# Altium project S3220A.PrjPcb
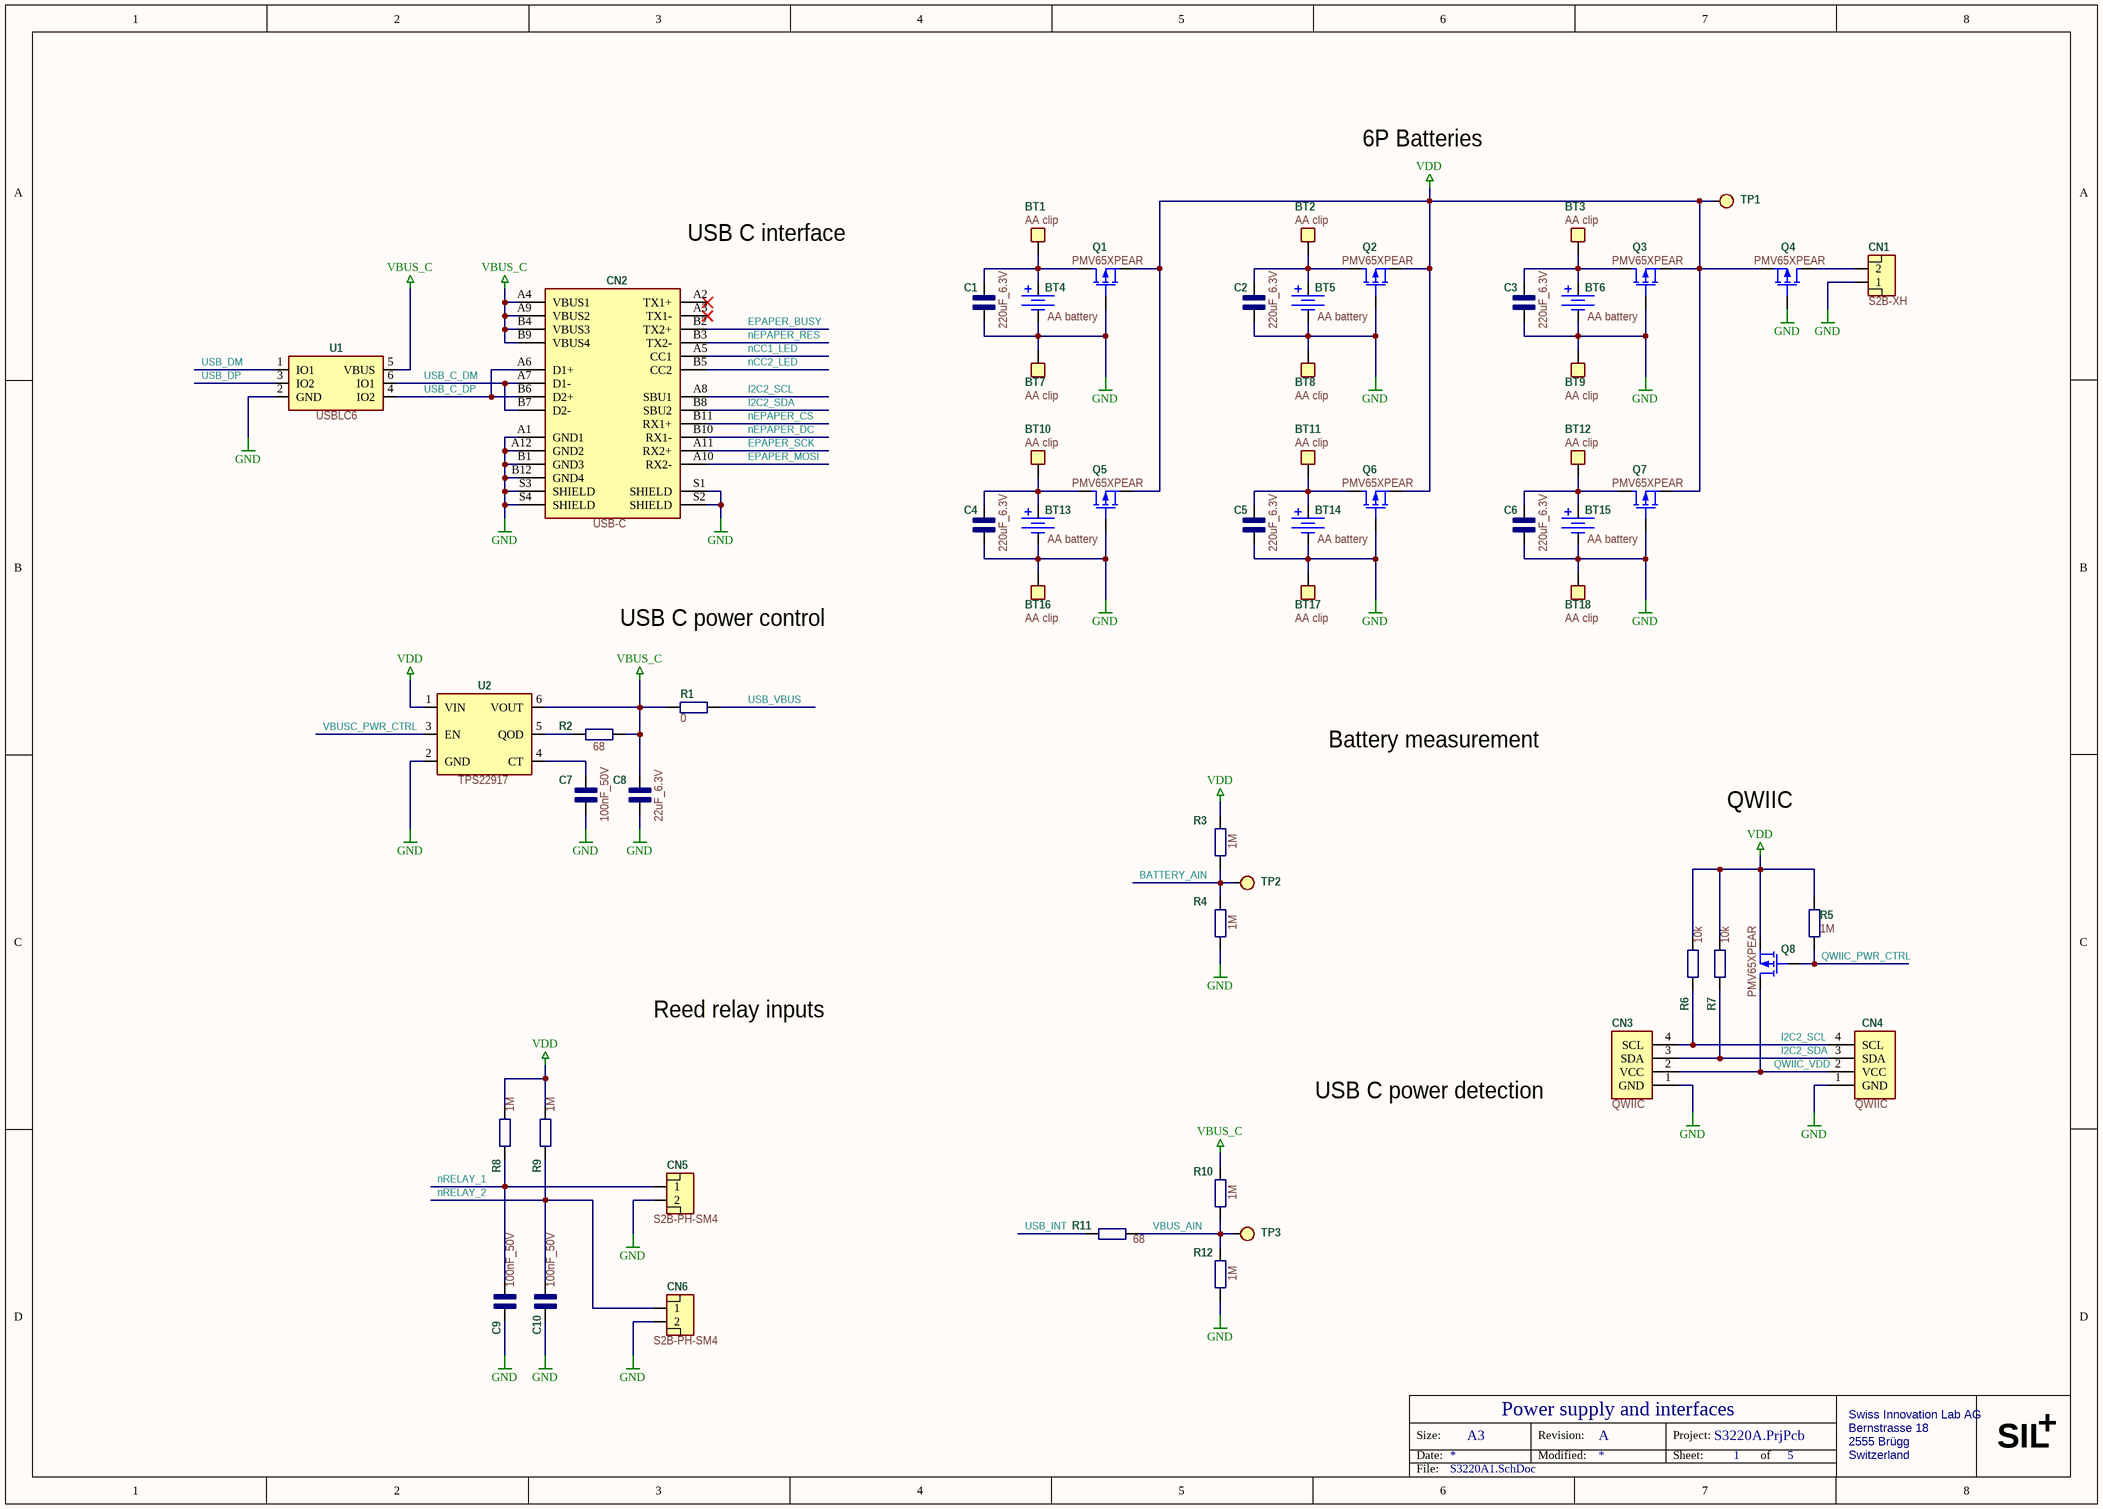
[diagram p0: S3220A1.SchDoc]
4 sheets, 238 parts. Net scope: global (net labels, ports and power ports of the same name join across sheets).
Board files: S3220A.PcbDoc, Panelized_S3220A.PcbDoc
Sheets:
  S3220A1.SchDoc
  S3220A2.SchDoc
  S3220A3.SchDoc
  S3220A4.SchDoc

## Sheet S3220A1.SchDoc: Power supply and interfaces
size A3; Revision: A; SheetNumber: 1; SheetTotal: 5

### Parts
BT1  AA clip  [BT_AA-TH-CLIP]  (no BOM)
BT2  AA clip  [BT_AA-TH-CLIP]  (no BOM)
BT3  AA clip  [BT_AA-TH-CLIP]  (no BOM)
BT4  AA battery  [BT_AA-battery]  (no BOM)
BT5  AA battery  [BT_AA-battery]  (no BOM)
BT6  AA battery  [BT_AA-battery]  (no BOM)
BT7  AA clip  [BT_AA-TH-CLIP]  (no BOM)
BT8  AA clip  [BT_AA-TH-CLIP]  (no BOM)
BT9  AA clip  [BT_AA-TH-CLIP]  (no BOM)
BT10  AA clip  [BT_AA-TH-CLIP]  (no BOM)
BT11  AA clip  [BT_AA-TH-CLIP]  (no BOM)
BT12  AA clip  [BT_AA-TH-CLIP]  (no BOM)
BT13  AA battery  [BT_AA-battery]  (no BOM)
BT14  AA battery  [BT_AA-battery]  (no BOM)
BT15  AA battery  [BT_AA-battery]  (no BOM)
BT16  AA clip  [BT_AA-TH-CLIP]  (no BOM)
BT17  AA clip  [BT_AA-TH-CLIP]  (no BOM)
BT18  AA clip  [BT_AA-TH-CLIP]  (no BOM)
C1  220uF_6.3V  [C_1206]
C2  220uF_6.3V  [C_1206]
C3  220uF_6.3V  [C_1206]
C4  220uF_6.3V  [C_1206]
C5  220uF_6.3V  [C_1206]
C6  220uF_6.3V  [C_1206]
C7  100nF_50V  [C_0603]
C8  22uF_6.3V  [C_0603]
C9  100nF_50V  [C_0603]
C10  100nF_50V  [C_0603]
CN1  S2B-XH  [CN_S2B-XH-A]
CN2  USB-C  [CN_USB-C-RA_2]
CN3  QWIIC  [CN_SM04B-SRSS-TB]
CN4  QWIIC  [CN_SM04B-SRSS-TB]
CN5  S2B-PH-SM4  [CN_S2B-PH-SM4]
CN6  S2B-PH-SM4  [CN_S2B-PH-SM4]
Q1  PMV65XPEAR  [U_SOT23-3]
Q2  PMV65XPEAR  [U_SOT23-3]
Q3  PMV65XPEAR  [U_SOT23-3]
Q4  PMV65XPEAR  [U_SOT23-3]
Q5  PMV65XPEAR  [U_SOT23-3]
Q6  PMV65XPEAR  [U_SOT23-3]
Q7  PMV65XPEAR  [U_SOT23-3]
Q8  PMV65XPEAR  [U_SOT23-3]
R1  0  [R_0603]
R2  68  [R_0603]
R3  1M  [R_0603]
R4  1M  [R_0603]
R5  1M  [R_0603]
R6  10k  [R_0603]
R7  10k  [R_0603]
R8  1M  [R_0603]
R9  1M  [R_0603]
R10  1M  [R_0603]
R11  68  [R_0603]
R12  1M  [R_0603]
TP1  Test point  [TP_SMD_R1.0mm]  (value not drawn)  (no BOM)
TP2  Test point  [TP_SMD_R1.0mm]  (value not drawn)  (no BOM)
TP3  Test point  [TP_SMD_R1.0mm]  (value not drawn)  (no BOM)
U1  USBLC6  [U_SOT23-6]
U2  TPS22917  [U_SOT23-6]

### Nets
GND: BT7.1 BT8.1 BT9.1 BT16.1 BT17.1 BT18.1 C1.1 C2.1 C3.1 C4.1 C5.1 C6.1 C7.1 C8.1 C9.1 C10.1 CN1.1 CN2.A1(GND1) CN2.A12(GND2) CN2.B1(GND3) CN2.B12(GND4) CN2.S1(SHIELD) CN2.S2(SHIELD) CN2.S3(SHIELD) CN2.S4(SHIELD) CN3.1(GND) CN4.1(GND) CN5.2 CN6.2 Q1.1(G) Q2.1(G) Q3.1(G) Q4.1(G) Q5.1(G) Q6.1(G) Q7.1(G) R4.1 R12.1 U1.2(GND) U2.2(GND)
VBUS_C: C8.2 CN2.A4(VBUS1) CN2.A9(VBUS2) CN2.B4(VBUS3) CN2.B9(VBUS4) R1.1 R2.1 R10.2 U1.5(VBUS) U2.6(VOUT)
VDD: Q1.2(S) Q2.2(S) Q3.2(S) Q4.2(S) Q5.2(S) Q6.2(S) Q7.2(S) Q8.2(S) R3.2 R5.2 R6.2 R7.2 R8.2 R9.2 TP1.1 U2.1(VIN)
BATTERY_AIN: R3.1 R4.2 TP2.1
EPAPER_BUSY: CN2.B2(TX2+)
EPAPER_MOSI: CN2.A10(RX2-)
EPAPER_SCK: CN2.A11(RX2+)
I2C2_SCL: CN2.A8(SBU1) CN3.4(SCL) CN4.4(SCL) R6.1
I2C2_SDA: CN2.B8(SBU2) CN3.3(SDA) CN4.3(SDA) R7.1
nCC1_LED: CN2.A5(CC1)
nCC2_LED: CN2.B5(CC2)
nEPAPER_CS: CN2.B11(RX1+)
nEPAPER_DC: CN2.B10(RX1-)
nEPAPER_RES: CN2.B3(TX2-)
nRELAY_1: C9.2 CN5.1 R8.1
nRELAY_2: C10.2 CN6.1 R9.1
QWIIC_PWR_CTRL: Q8.1(G) R5.1
QWIIC_VDD: CN3.2(VCC) CN4.2(VCC) Q8.3(D)
USB_C_DM: CN2.A7(D1-) CN2.B7(D2-) U1.6(IO1)
USB_C_DP: CN2.A6(D1+) CN2.B6(D2+) U1.4(IO2)
USB_DM: U1.1(IO1)
USB_DP: U1.3(IO2)
USB_INT: R11.1
USB_VBUS: R1.2
VBUS_AIN: R10.1 R11.2 R12.2 TP3.1
VBUSC_PWR_CTRL: U2.3(EN)
NetBT1_1: BT1.1 C1.2 Q1.3(D)
NetBT2_1: BT2.1 C2.2 Q2.3(D)
NetBT3_1: BT3.1 C3.2 Q3.3(D)
NetBT10_1: BT10.1 C4.2 Q5.3(D)
NetBT11_1: BT11.1 C5.2 Q6.3(D)
NetBT12_1: BT12.1 C6.2 Q7.3(D)
NetC7_2: C7.2 U2.4(CT)
NetCN1_2: CN1.2 Q4.3(D)
NetR2_2: R2.2 U2.5(QOD)

Not connected (* = marked no-connect by the designer): CN2 A2(TX1+)* A3(TX1-)*

### Notes on the sheet
- 6P Batteries
- USB C interface
- USB C power control
- Battery measurement
- QWIIC
- Reed relay inputs
- USB C power detection
- Size:
- Date:
- A3
- Revision:
- Modified:
- Project:
- Sheet:
- of
- Swiss Innovation Lab AG
- Bernstrasse 18
- 2555 Brügg
- Switzerland
- SIL
- +
- File:

### Library data of the parts
BT1-BT3 BT7-BT12 BT16-BT18 = BT_AA-TH-CLIP: Battery Contact Clip A, AA 1 Cell PC Pin; Manufacturer: Keystone Electronics; Manufacturer Part Number: 92; Currency: $; Value: AA clip; Price: 0,20178; Supplier 1: Digi-Key; Supplier Part Number 1: 36-92-ND
BT4-BT6 BT13-BT15 = BT_AA-battery: Manufacturer: SIL; Currency: $; Value: AA battery; Supplier 1: SIL
C1-C6 = C_220uF_6.3V: 220µF ±20% 6.3V Ceramic Capacitor X5R 1206 (3216 Metric); Manufacturer: Murata Electronics North America; Manufacturer Part Number: GRM31CR60J227ME11L; Value: 220uF; ValueAux: _6.3V; Currency: $; Price: 0,59945; Supplier 1: Digi-Key; Supplier Part Number 1: 490-13970-1-ND
C7 C9 C10 = C_100nF_50V: 0.1µF ±10% 50V Ceramic Capacitor X7R 0603 (1608 Metric); Manufacturer: TDK; Manufacturer Part Number: C1608X7R1H104K080AA; Value: 100nF; ValueAux: _50V; Currency: $; Price: 0,01309; Supplier 1: Digi-Key; Supplier Part Number 1: 445-1314-6-ND
C8 = C_22uF_6V3: 22µF ±20% 6.3V Ceramic Capacitor X5R 0603 (1608 Metric); Manufacturer: Samsung Electro-Mechanics; Manufacturer Part Number: CL10A226MQ8NRNC; Value: 22uF; ValueAux: _6.3V; Currency: $; Price: 0,04566; Supplier 1: Digi-Key; Supplier Part Number 1: 1276-1193-1-ND
CN1 = CN_S2B-XH: Connector Header Through Hole, Right Angle 2 position 0.098" (2.50mm); Manufacturer: JST Sales America Inc.; Manufacturer Part Number: S2B-XH-A(LF)(SN); Currency: $; Supplier 1: Digi-Key; Supplier Part Number 1: 455-2257-ND; Value: S2B-XH; Price: 0,07792
CN2 = CN_USB-C-RA_2: USB-C (USB TYPE-C) USB 3.2 Gen 2 (USB 3.1 Gen 2, Superspeed + (USB 3.1)) Receptacle Connector 24 Position Surface Mount, Right Angle; Through Hole; Manufacturer: CUI Devices; Manufacturer Part Number: UJ31-CH-G-SMT-TR-67; Currency: $; Value: USB-C; Price: 2,43252; Supplier 1: Digi-Key; Supplier Part Number 1: 2223-UJ31-CH-G-SMT-TR-67CT-ND
CN3 CN4 = CN_QWICC: Connector Header Surface Mount, Right Angle 4 position 0.039" (1.00mm); Manufacturer: JST Sales America Inc.; Manufacturer Part Number: SM04B-SRSS-TB(LF)(SN); Currency: $; Supplier 1: Digi-Key; Supplier Part Number 1: 455-1804-1-ND; Value: QWIIC; Price: 0,61
CN5 CN6 = CN_S2B-PH-SM4: Connector Header Surface Mount, Right Angle 2 position 0.079" (2.00mm); Manufacturer: JST Sales America Inc.; Manufacturer Part Number: S2B-PH-SM4-TB(LF)(SN); Currency: $; Supplier 1: Digi-Key; Supplier Part Number 1: 455-1749-1-ND; Value: S2B-PH-SM4; Price: 0,36470
Q1-Q8 = Q_PMV65: P-Channel 20V 2.8A (Ta) 480mW (Ta), 6.25W (Tc) Surface Mount TO-236AB (SOT23); Manufacturer: Nexperia USA Inc.; Currency: $; Value: PMV65XPEAR; Manufacturer Part Number: PMV65XPEAR; Price: 0,11204; Supplier 1: Digi-Key; Supplier Part Number 1: 1727-2310-1-ND
R1 = R_0_1%: 0 Ohms Jumper 0.1W, 1/10W Chip Resistor 0603 (1608 Metric) Automotive AEC-Q200 Thick Film; Manufacturer: Panasonic Electronic Components; Manufacturer Part Number: ERJ-3GEY0R00V; Currency: $; Value: 0; Price: 0,00962; Supplier 1: Digi-Key; Supplier Part Number 1: P0.0GCT-ND
R2 R11 = R_68_1%: 68 Ohms ±1% 0.1W, 1/10W Chip Resistor 0603 (1608 Metric) Automotive AEC-Q200 Thick Film; Manufacturer: Panasonic Electronic Components; Manufacturer Part Number: ERJ-3EKF68R0V; Currency: $; Value: 68; Price: 0,01449; Supplier 1: Digi-Key; Supplier Part Number 1: P68.0HCT-ND
R3-R5 R8-R10 R12 = R_1M_1%: 1 MOhms ±1% 0.1W, 1/10W Chip Resistor 0603 (1608 Metric) Automotive AEC-Q200 Thick Film; Manufacturer: Panasonic Electronic Components; Manufacturer Part Number: ERJ-3EKF1004V; Currency: $; Value: 1M; Price: 0,01264; Supplier 1: Digi-Key; Supplier Part Number 1: P1.00MHCT-ND
R6 R7 = R_10k_1%: 10 kOhms ±1% 0.1W, 1/10W Chip Resistor 0603 (1608 Metric) Automotive AEC-Q200 Thick Film; Manufacturer: Panasonic Electronic Components; Manufacturer Part Number: ERJ-3EKF1002V; Currency: $; Value: 10k; Price: 0,01449; Supplier 1: Digi-Key; Supplier Part Number 1: P10.0KHCT-ND
TP1-TP3 = TP_Test_point: Manufacturer: Swiss Innovation Lab; Currency: $; Value: Test point; Manufacturer Part Number: Test point; Price: 0
U1 = U_USBLC6: TVS DIODE 5.25V 17V SOT23-6; Manufacturer: STMicroelectronics; Manufacturer Part Number: USBLC6-2SC6Y; Currency: $; Value: USBLC6; Price: 0,33501; Supplier 1: Digi-Key; Supplier Part Number 1: 497-11882-6-ND
U2 = U_TPS22917: Power Switch/Driver 1:1 P-Channel 2A SOT-23-6; Manufacturer: Texas Instruments; Manufacturer Part Number: TPS22917DBVR; Currency: $; Value: TPS22917; Price: 0,19065; Supplier 1: Digi-Key; Supplier Part Number 1: 296-50498-1-ND

## Sheet S3220A2.SchDoc: CPU
size A3; Revision: A; SheetNumber: 2; SheetTotal: 5
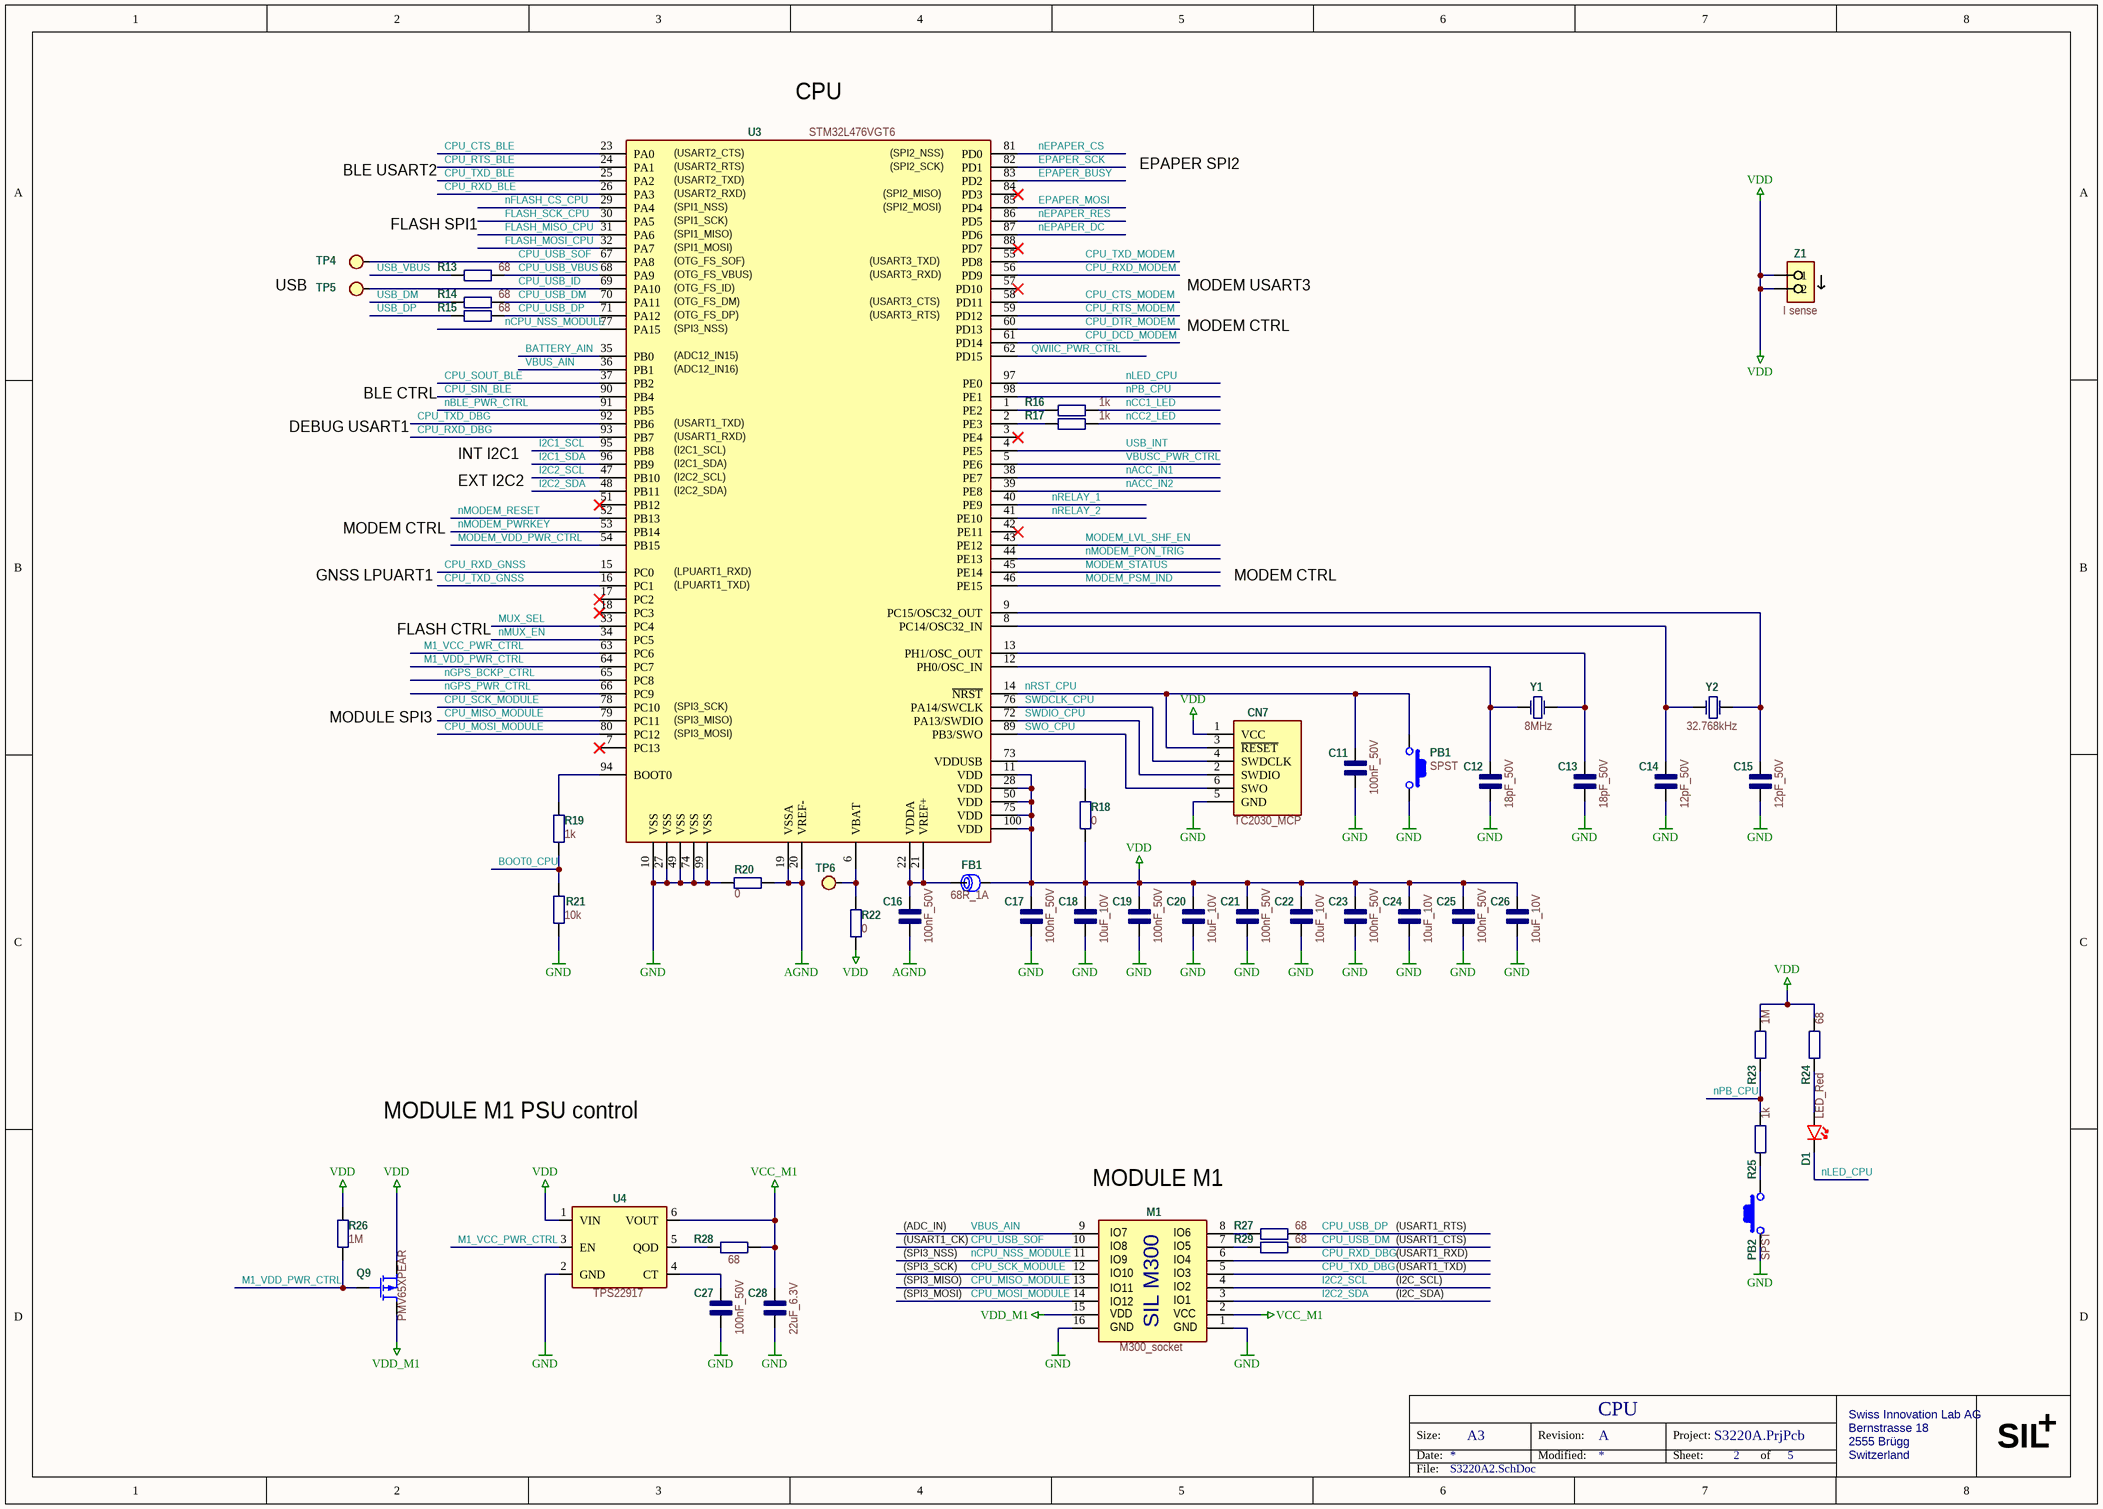
[diagram p1: S3220A2.SchDoc]

### Parts
C11  100nF_50V  [C_0603]
C12  18pF_50V  [C_0603]
C13  18pF_50V  [C_0603]
C14  12pF_50V  [C_0603]
C15  12pF_50V  [C_0603]
C16  100nF_50V  [C_0603]
C17  100nF_50V  [C_0603]
C18  10uF_10V  [C_0603]
C19  100nF_50V  [C_0603]
C20  10uF_10V  [C_0603]
C21  100nF_50V  [C_0603]
C22  10uF_10V  [C_0603]
C23  100nF_50V  [C_0603]
C24  10uF_10V  [C_0603]
C25  100nF_50V  [C_0603]
C26  10uF_10V  [C_0603]
C27  100nF_50V  [C_0603]
C28  22uF_6.3V  [C_0603]
CN7  TC2030_MCP  [CN_TC2030-MCP-NL]  (no BOM)
D1  LED_Red  [LED_0603]
FB1  68R_1A  [L_0603]
M1  M300_socket  [M_M300_socket]  (no BOM)
PB1  SPST  [PB_PTS810]
PB2  SPST  [PB_PTS810]
Q9  PMV65XPEAR  [U_SOT23-3]
R13  68  [R_0603]
R14  68  [R_0603]
R15  68  [R_0603]
R16  1k  [R_0603]
R17  1k  [R_0603]
R18  0  [R_0603]
R19  1k  [R_0603]
R20  0  [R_0603]
R21  10k  [R_0603]
R22  0  [R_0603]
R23  1M  [R_0603]
R24  68  [R_0603]
R25  1k  [R_0603]
R26  1M  [R_0603]
R27  68  [R_0603]
R28  68  [R_0603]
R29  68  [R_0603]
TP4  Test point  [TP_SMD_R1.0mm]  (value not drawn)  (no BOM)
TP5  Test point  [TP_SMD_R1.0mm]  (value not drawn)  (no BOM)
TP6  Test point  [TP_SMD_R1.0mm]  (value not drawn)  (no BOM)
U3  STM32L476VGT6  [U_100-LQFP]
U4  TPS22917  [U_SOT23-6]
Y1  8MHz  [Y_ABMM2]
Y2  32.768kHz  [Y_XTAL-3215]
Z1  I sense  [Z_I_SENSE]  (no BOM)

### Nets
AGND: C16.1 R20.2 U3.19(VSSA) U3.20(VREF-)
GND: C11.1 C12.1 C13.1 C14.1 C15.1 C17.1 C18.1 C19.1 C20.1 C21.1 C22.1 C23.1 C24.1 C25.1 C26.1 C27.1 C28.1 CN7.5(GND) M1.1(GND) M1.16(GND) PB1.1 PB2.2 R20.1 R21.1 U3.10(VSS) U3.27(VSS) U3.49(VSS) U3.74(VSS) U3.99(VSS) U4.2(GND)
VCC_M1: C28.2 M1.2(5V) R28.1 U4.6(VOUT)
VDD: C17.2 C18.2 C19.2 C20.2 C21.2 C22.2 C23.2 C24.2 C25.2 C26.2 CN7.1(VCC) FB1.2 Q9.2(S) R18.2 R22.1 R23.1 R24.2 R26.2 U3.11(VDD) U3.28(VDD) U3.50(VDD) U3.75(VDD) U3.100(VDD) U4.1(VIN) Z1.1 Z1.2
VDD_M1: M1.15(3.3V) Q9.3(D)
BATTERY_AIN: U3.35(PB0)
BOOT0_CPU: R19.1 R21.2
CPU_CTS_BLE: U3.23(PA0)
CPU_CTS_MODEM: U3.58(PD11)
CPU_DCD_MODEM: U3.61(PD14)
CPU_DTR_MODEM: U3.60(PD13)
CPU_MISO_MODULE: M1.13(MISO) U3.79(PC11)
CPU_MOSI_MODULE: M1.14(MOSI) U3.80(PC12)
CPU_RTS_BLE: U3.24(PA1)
CPU_RTS_MODEM: U3.59(PD12)
CPU_RXD_BLE: U3.26(PA3)
CPU_RXD_DBG: M1.6(RX) U3.93(PB7)
CPU_RXD_GNSS: U3.15(PC0)
CPU_RXD_MODEM: U3.56(PD9)
CPU_SCK_MODULE: M1.12(SCK) U3.78(PC10)
CPU_SIN_BLE: U3.90(PB4)
CPU_SOUT_BLE: U3.37(PB2)
CPU_TXD_BLE: U3.25(PA2)
CPU_TXD_DBG: M1.5(TX) U3.92(PB6)
CPU_TXD_GNSS: U3.16(PC1)
CPU_TXD_MODEM: U3.55(PD8)
CPU_USB_DM: R14.2 R29.2 U3.70(PA11)
CPU_USB_DP: R15.2 R27.2 U3.71(PA12)
CPU_USB_ID: TP5.1 U3.69(PA10)
CPU_USB_SOF: M1.10(RST) TP4.1 U3.67(PA8)
CPU_USB_VBUS: R13.2 U3.68(PA9)
EPAPER_BUSY: U3.83(PD2)
EPAPER_MOSI: U3.85(PD4)
EPAPER_SCK: U3.82(PD1)
FLASH_MISO_CPU: U3.31(PA6)
FLASH_MOSI_CPU: U3.32(PA7)
FLASH_SCK_CPU: U3.30(PA5)
I2C1_SCL: U3.95(PB8)
I2C1_SDA: U3.96(PB9)
I2C2_SCL: M1.4(SCL) U3.47(PB10)
I2C2_SDA: M1.3(SDA) U3.48(PB11)
M1_VCC_PWR_CTRL: U3.63(PC6) U4.3(EN)
M1_VDD_PWR_CTRL: Q9.1(G) R26.1 U3.64(PC7)
MODEM_LVL_SHF_EN: U3.43(PE12)
MODEM_PSM_IND: U3.46(PE15)
MODEM_STATUS: U3.45(PE14)
MODEM_VDD_PWR_CTRL: U3.54(PB15)
MUX_SEL: U3.33(PC4)
nACC_IN1: U3.38(PE7)
nACC_IN2: U3.39(PE8)
nBLE_PWR_CTRL: U3.91(PB5)
nCC1_LED: R16.1
nCC2_LED: R17.1
nCPU_NSS_MODULE: M1.11(CS) U3.77(PA15)
nEPAPER_CS: U3.81(PD0)
nEPAPER_DC: U3.87(PD6)
nEPAPER_RES: U3.86(PD5)
nFLASH_CS_CPU: U3.29(PA4)
nGPS_BCKP_CTRL: U3.65(PC8)
nGPS_PWR_CTRL: U3.66(PC9)
nLED_CPU: D1.2(K) U3.97(PE0)
nMODEM_PON_TRIG: U3.44(PE13)
nMODEM_PWRKEY: U3.53(PB14)
nMODEM_RESET: U3.52(PB13)
nMUX_EN: U3.34(PC5)
nPB_CPU: R23.2 R25.2 U3.98(PE1)
nRELAY_1: U3.40(PE9)
nRELAY_2: U3.41(PE10)
nRST_CPU: C11.2 CN7.3(~{RESET}) PB1.2 U3.14(~{NRST})
QWIIC_PWR_CTRL: U3.62(PD15)
SWDCLK_CPU: CN7.4(SWDCLK) U3.76(PA14/SWCLK)
SWDIO_CPU: CN7.2(SWDIO) U3.72(PA13/SWDIO)
SWO_CPU: CN7.6(SWO) U3.89(PB3/SWO)
USB_DM: R14.1
USB_DP: R15.1
USB_INT: U3.4(PE5)
USB_VBUS: R13.1
VBUS_AIN: M1.9(AN) U3.36(PB1)
VBUSC_PWR_CTRL: U3.5(PE6)
NetC12_2: C12.2 U3.12(PH0/OSC_IN) Y1.1(inp)
NetC13_2: C13.2 U3.13(PH1/OSC_OUT) Y1.3(out)
NetC14_2: C14.2 U3.8(PC14/OSC32_IN) Y2.1(inp)
NetC15_2: C15.2 U3.9(PC15/OSC32_OUT) Y2.2(out)
NetC16_2: C16.2 FB1.1 U3.21(VREF+) U3.22(VDDA)
NetC27_2: C27.2 U4.4(CT)
NetD1_1: D1.1(A) R24.1
NetM1_7: M1.7(INT) R29.1
NetM1_8: M1.8(PWM) R27.1
NetPB2_1: PB2.1 R25.1
NetR16_2: R16.2 U3.1(PE2)
NetR17_2: R17.2 U3.2(PE3)
NetR18_1: R18.1 U3.73(VDDUSB)
NetR19_2: R19.2 U3.94(BOOT0)
NetR22_2: R22.2 TP6.1 U3.6(VBAT)
NetR28_2: R28.2 U4.5(QOD)

Not connected (* = marked no-connect by the designer): U3 3(PE4)* 7(PC13)* 17(PC2)* 18(PC3)* 42(PE11)* 51(PB12)* 57(PD10)* 84(PD3)* 88(PD7)*

### Notes on the sheet
- (near U3) CPU
- BLE USART2
- (near U3) (USART2_TXD)
- (near U3) (USART2_CTS)
- (near U3) (USART2_RTS)
- (near U3) (SPI2_SCK)
- (near U3) (SPI2_NSS)
- EPAPER SPI2
- FLASH SPI1
- (near U3) (USART2_RXD)
- (near U3) (SPI1_MISO)
- (near U3) (SPI1_SCK)
- (near U3) (SPI1_NSS)
- (near U3) (SPI2_MOSI)
- (near U3) (SPI2_MISO)
- USB
- (near U3) (SPI1_MOSI)
- (near U3) (OTG_FS_DM)
- (near U3) (OTG_FS_DP)
- (near U3) (OTG_FS_SOF)
- (near U3) (OTG_FS_VBUS)
- (near U3) (OTG_FS_ID)
- (near U3) (USART3_CTS)
- (near U3) (USART3_RTS)
- (near U3) (USART3_TXD)
- (near U3) (USART3_RXD)
- MODEM USART3
- (near U3) (SPI3_NSS)
- (near U3) (ADC12_IN15)
- (near U3) (ADC12_IN16)
- MODEM CTRL
- DEBUG USART1
- BLE CTRL
- (near U3) (USART1_TXD)
- (near U3) (USART1_RXD)
- (near U3) (I2C1_SCL)
- INT I2C1
- EXT I2C2
- (near U3) (I2C2_SCL)
- (near U3) (I2C2_SDA)
- (near U3) (I2C1_SDA)
- GNSS LPUART1
- (near U3) (LPUART1_TXD)
- (near U3) (LPUART1_RXD)
- FLASH CTRL
- MODULE SPI3
- (near U3) (SPI3_SCK)
- (near U3) (SPI3_MISO)
- (near U3) (SPI3_MOSI)
- MODULE M1 PSU control
- (near M1) MODULE M1
- (USART1_CK)
- (SPI3_NSS)
- (ADC_IN)
- (USART1_CTS)
- (USART1_RTS)
- (USART1_RXD)
- (SPI3_SCK)
- (SPI3_MISO)
- (SPI3_MOSI)
- (I2C_SCL)
- (I2C_SDA)
- (USART1_TXD)
- Size:
- Date:
- A3
- Revision:
- Modified:
- Project:
- Sheet:
- of
- Swiss Innovation Lab AG
- Bernstrasse 18
- 2555 Brügg
- Switzerland
- SIL
- +
- File:
- (in symbol M_M300_socket) IO7; IO6; IO8; IO5; IO9; IO4; IO10; IO3; IO11; IO2; IO12; IO1; VDD; VCC; SIL M300

### Library data of the parts
C11 C16 C17 C19 C21 C23 C25 C27 = C_100nF_50V: as C7 on sheet S3220A1; Price: 0,01309; Supplier 1: Digi-Key; Supplier Part Number 1: 445-1314-6-ND
C12 C13 = C_18pF_50V: 18pF ±5% 50V Ceramic Capacitor C0G, NP0 0603 (1608 Metric); Manufacturer: KEMET; Manufacturer Part Number: C0603C180J5GACTU; ValueAux: _50V; Currency: $; Value: 18pF; Price: 0,00974; Supplier 1: Digi-Key; Supplier Part Number 1: 399-1052-1-ND
C14 C15 = C_12pF_50V: 12pF ±1% 50V Ceramic Capacitor C0G, NP0 0603 (1608 Metric); Manufacturer: Samsung Electro-Mechanics; Manufacturer Part Number: CL10C120FB8NNNC; ValueAux: _50V; Currency: $; Value: 12pF; Price: 0,05153; Supplier 1: Digi-Key; Supplier Part Number 1: 1276-2175-1-ND
C18 C20 C22 C24 C26 = C_10uF_10V: 10µF ±10% 10V Ceramic Capacitor X5R 0603 (1608 Metric); Manufacturer: Murata Electronics North America; Manufacturer Part Number: GRM188R61A106KE69D; Value: 10uF; ValueAux: _10V; Currency: $; Price: 0,03994; Supplier 1: Digi-Key; Supplier Part Number 1: 490-10474-1-ND
C28 = C_22uF_6V3: as C8 on sheet S3220A1; Price: 0,04566; Supplier 1: Digi-Key; Supplier Part Number 1: 1276-1193-1-ND
CN7 = CN_TC2030: TC2030-MCP-NL; Value: TC2030; ValueAux: _MCP; Currency: $; Price: 0
D1 = D_LED_R_5mA: Red 631nm LED Indication - Discrete 2V 0603; Manufacturer: Lite-On Inc.; Manufacturer Part Number: LTST-C193KRKT-5A; ValueAux: _Red; Currency: $; Value: LED; Price: 0,07565; Supplier 1: Digi-Key; Supplier Part Number 1: 160-1830-1-ND
FB1 = FB_68R_1A: FERRITE BEAD 68 OHM 0603 1LN; Manufacturer: Laird-Signal Integrity Products; Manufacturer Part Number: MI0603J680R-10; Value: 68R; ValueAux: _1A; Currency: $; Price: 0,02658; Supplier 1: Digi-Key; Supplier Part Number 1: 240-2372-1-ND
M1 = M_M300_socket: Module M300 motherboard socket; Manufacturer: Swiss Innovation Lab; Currency: $; Value: M300; ValueAux: _socket; Manufacturer Part Number: M300; Price: 0; Supplier 1: Swiss Innovation Lab; Supplier Part Number 1: M300
PB1 PB2 = PB_SPST_2.5mm: Tactile Switch SPST-NO Top Actuated Surface Mount; Manufacturer: C&K; Manufacturer Part Number: PTS810 SJM 250 SMTR LFS; Currency: $; Value: SPST; Price: 0,17302; Supplier 1: Digi-Key; Supplier Part Number 1: CKN10502DKR-ND
Q9 = Q_PMV65: as Q1 on sheet S3220A1; Value: PMV65XPEAR; Manufacturer Part Number: PMV65XPEAR; Price: 0,11204; Supplier 1: Digi-Key; Supplier Part Number 1: 1727-2310-1-ND
R13-R15 R24 R27-R29 = R_68_1%: as R2 on sheet S3220A1; Value: 68; Price: 0,01449; Supplier 1: Digi-Key; Supplier Part Number 1: P68.0HCT-ND
R16 R17 R19 R25 = R_1k_1%: 1 kOhms ±1% 0.1W, 1/10W Chip Resistor 0603 (1608 Metric) Automotive AEC-Q200 Thick Film; Manufacturer: Panasonic Electronic Components; Manufacturer Part Number: ERJ-3EKF1001V; Currency: $; Value: 1k; Price: 0,01153; Supplier 1: Digi-Key; Supplier Part Number 1: P1.00KHCT-ND
R18 R20 R22 = R_0_1%: as R1 on sheet S3220A1; Value: 0; Price: 0,00962; Supplier 1: Digi-Key; Supplier Part Number 1: P0.0GCT-ND
R21 = R_10k_1%: as R6 on sheet S3220A1; Value: 10k; Price: 0,01449; Supplier 1: Digi-Key; Supplier Part Number 1: P10.0KHCT-ND
R23 R26 = R_1M_1%: as R3 on sheet S3220A1; Value: 1M; Price: 0,01264; Supplier 1: Digi-Key; Supplier Part Number 1: P1.00MHCT-ND
TP4-TP6 = TP_Test_point: as TP1 on sheet S3220A1; Value: Test point; Manufacturer Part Number: Test point; Price: 0
U3 = U_STM32L476: ARM® Cortex®-M4 STM32L4 Microcontroller IC 32-Bit 80MHz 1MB (1M x 8) FLASH 100-LQFP (14x14); Manufacturer: STMicroelectronics; Currency: $; Value: STM32L476VGT6; Manufacturer Part Number: STM32L476VGT6; Price: 5,98590; Supplier 1: Digi-Key; Supplier Part Number 1: 497-15873-ND
U4 = U_TPS22917: as U2 on sheet S3220A1; Value: TPS22917; Price: 0,19065; Supplier 1: Digi-Key; Supplier Part Number 1: 296-50498-1-ND
Y1 = Y_8MHz_20ppm: 8MHz ±20ppm Crystal 18pF 72 Ohms 4-SMD, No Lead; Manufacturer: Abracon LLC; Manufacturer Part Number: ABMM2-8.000MHZ-E2-T; Currency: $; Value: 8MHz; Price: 0,49500; Supplier 1: Digi-Key; Supplier Part Number 1: 535-9628-1-ND
Y2 = Y_32kHz_10ppm: 32.768kHz ±10ppm Crystal 12.5pF 70 kOhms 2-SMD, No Lead; Manufacturer: ECS Inc.; Manufacturer Part Number: ECS-.327-12.5-34B-C-TR; Currency: $; Value: 32.768kHz; Price: 0,42900; Supplier 1: Digi-Key; Supplier Part Number 1: XC1968CT-ND
Z1 = Z_I_sense: 2 Positions Header Connector 0.100" (2.54mm) SMD Gold for current measurement; Manufacturer: SIL; Currency: $; Value: I sense; Manufacturer Part Number: I sense; Price: 0; Supplier 1: SIL; Supplier Part Number 1: I sense

## Sheet S3220A3.SchDoc: Modem BG95
size A3; Revision: A; SheetNumber: 3; SheetTotal: 5
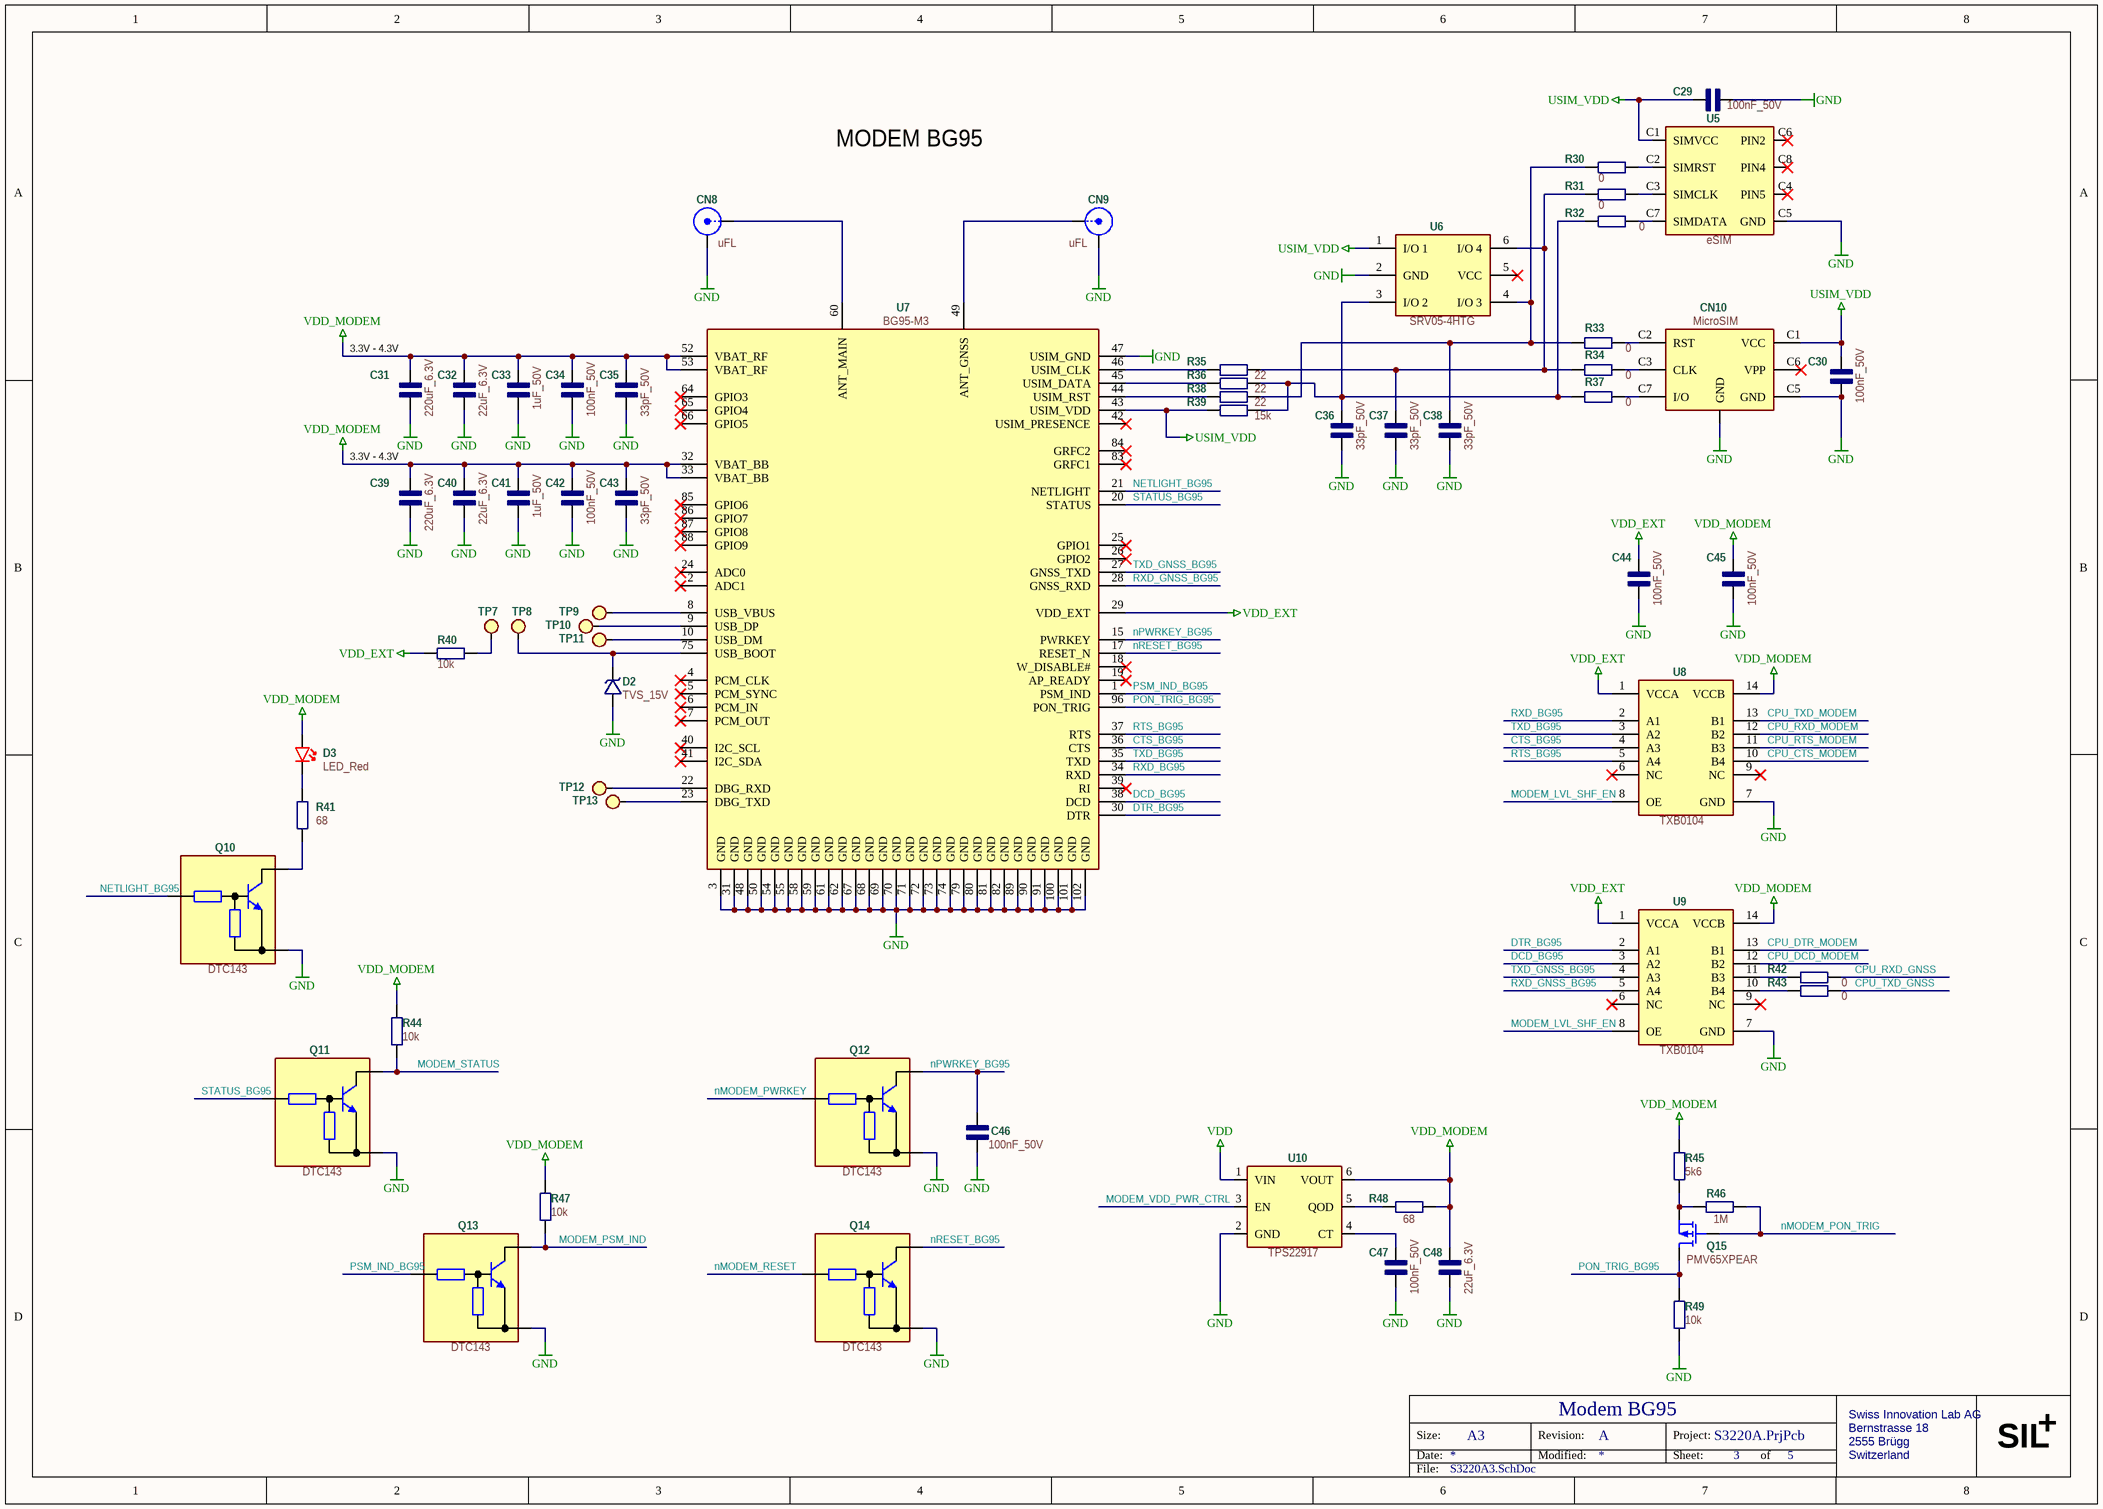
[diagram p2: S3220A3.SchDoc]

### Parts
C29  100nF_50V  [C_0603]
C30  100nF_50V  [C_0603]
C31  220uF_6.3V  [C_1206]
C32  22uF_6.3V  [C_0603]
C33  1uF_50V  [C_0603]
C34  100nF_50V  [C_0603]
C35  33pF_50V  [C_0603]
C36  33pF_50V  [C_0603]
C37  33pF_50V  [C_0603]
C38  33pF_50V  [C_0603]
C39  220uF_6.3V  [C_1206]
C40  22uF_6.3V  [C_0603]
C41  1uF_50V  [C_0603]
C42  100nF_50V  [C_0603]
C43  33pF_50V  [C_0603]
C44  100nF_50V  [C_0603]
C45  100nF_50V  [C_0603]
C46  100nF_50V  [C_0603]
C47  100nF_50V  [C_0603]
C48  22uF_6.3V  [C_0603]
CN8  uFL  [CN_RF_uFL]
CN9  uFL  [CN_RF_uFL]
CN10  MicroSIM  [CN_MicroSIM-Holder]
D2  TVS_15V  [D_0603]
D3  LED_Red  [LED_0603]
Q10  DTC143  [Q_SOT-416]
Q11  DTC143  [Q_SOT-416]
Q12  DTC143  [Q_SOT-416]
Q13  DTC143  [Q_SOT-416]
Q14  DTC143  [Q_SOT-416]
Q15  PMV65XPEAR  [U_SOT23-3]
R30  0  [R_0603]
R31  0  [R_0603]
R32  0  [R_0603]
R33  0  [R_0603]
R34  0  [R_0603]
R35  22  [R_0603]
R36  22  [R_0603]
R37  0  [R_0603]
R38  22  [R_0603]
R39  15k  [R_0603]
R40  10k  [R_0603]
R41  68  [R_0603]
R42  0  [R_0603]
R43  0  [R_0603]
R44  10k  [R_0603]
R45  5k6  [R_0603]
R46  1M  [R_0603]
R47  10k  [R_0603]
R48  68  [R_0603]
R49  10k  [R_0603]
TP7  Test point  [TP_SMD_R1.0mm]  (value not drawn)  (no BOM)
TP8  Test point  [TP_SMD_R1.0mm]  (value not drawn)  (no BOM)
TP9  Test point  [TP_SMD_R1.0mm]  (value not drawn)  (no BOM)
TP10  Test point  [TP_SMD_R1.0mm]  (value not drawn)  (no BOM)
TP11  Test point  [TP_SMD_R1.0mm]  (value not drawn)  (no BOM)
TP12  Test point  [TP_SMD_R1.0mm]  (value not drawn)  (no BOM)
TP13  Test point  [TP_SMD_R1.0mm]  (value not drawn)  (no BOM)
U5  eSIM  [U_MFF2]
U6  SRV05-4HTG  [U_SOT23-6]
U7  BG95-M3  [U_BG96_BG95]
U8  TXB0104  [U_14-VQFN]
U9  TXB0104  [U_14-VQFN]
U10  TPS22917  [U_SOT23-6]

### Nets
GND: C29.1 C30.1 C31.1 C32.1 C33.2 C34.1 C35.1 C36.1 C37.1 C38.1 C39.1 C40.1 C41.2 C42.1 C43.1 C44.2 C45.2 C46.1 C47.1 C48.1 CN8.G CN9.G CN10.0(GND) CN10.C5(GND) D2.1 Q10.2(E) Q11.2(E) Q12.2(E) Q13.2(E) Q14.2(E) R49.2 U5.C5(GND) U6.2(GND) U7.3(GND) U7.31(GND) U7.47(USIM_GND) U7.48(GND) U7.50(GND) U7.54(GND) U7.55(GND) U7.58(GND) U7.59(GND) U7.61(GND) U7.62(GND) U7.67(GND) U7.68(GND) U7.69(GND) U7.70(GND) U7.71(GND) U7.72(GND) U7.73(GND) U7.74(GND) U7.79(GND) U7.80(GND) U7.81(GND) U7.82(GND) U7.89(GND) U7.90(GND) U7.91(GND) U7.100(GND) U7.101(GND) U7.102(GND) U8.7(GND) U9.7(GND) U10.2(GND)
USIM_VDD: C29.2 C30.2 CN10.C1(VCC) R39.1 U5.C1(SIMVCC) U6.1(I/O_1) U7.43(USIM_VDD)
VDD: U10.1(VIN)
VDD_EXT: C44.1 R40.1 U7.29(VDD_EXT) U8.1(VCCA) U9.1(VCCA)
VDD_MODEM: C31.2 C32.2 C33.1 C34.2 C35.2 C39.2 C40.2 C41.1 C42.2 C43.2 C45.1 C48.2 D3.1(A) R44.1 R45.2 R47.1 R48.2 U7.32(VBAT_BB) U7.33(VBAT_BB) U7.52(VBAT_RF) U7.53(VBAT_RF) U8.14(VCCB) U9.14(VCCB) U10.6(VOUT)
CPU_CTS_MODEM: U8.10(B4)
CPU_DCD_MODEM: U9.12(B2)
CPU_DTR_MODEM: U9.13(B1)
CPU_RTS_MODEM: U8.11(B3)
CPU_RXD_GNSS: R42.2
CPU_RXD_MODEM: U8.12(B2)
CPU_TXD_GNSS: R43.2
CPU_TXD_MODEM: U8.13(B1)
CTS_BG95: U7.36(CTS) U8.4(A3)
DCD_BG95: U7.38(DCD) U9.3(A2)
DTR_BG95: U7.30(DTR) U9.2(A1)
MODEM_LVL_SHF_EN: U8.8(OE) U9.8(OE)
MODEM_PSM_IND: Q13.3(C) R47.2
MODEM_STATUS: Q11.3(C) R44.2
MODEM_VDD_PWR_CTRL: U10.3(EN)
NETLIGHT_BG95: Q10.1(B) U7.21(NETLIGHT)
nMODEM_PON_TRIG: Q15.1(G) R46.1
nMODEM_PWRKEY: Q12.1(B)
nMODEM_RESET: Q14.1(B)
nPWRKEY_BG95: C46.2 Q12.3(C) U7.15(PWRKEY)
nRESET_BG95: Q14.3(C) U7.17(RESET_N)
PON_TRIG_BG95: Q15.3(D) R49.1 U7.96(PON_TRIG)
PSM_IND_BG95: Q13.1(B) U7.1(PSM_IND)
RTS_BG95: U7.37(RTS) U8.5(A4)
RXD_BG95: U7.34(RXD) U8.2(A1)
RXD_GNSS_BG95: U7.28(GNSS_RXD) U9.5(A4)
STATUS_BG95: Q11.1(B) U7.20(STATUS)
TXD_BG95: U7.35(TXD) U8.3(A2)
TXD_GNSS_BG95: U7.27(GNSS_TXD) U9.4(A3)
NetC36_2: C36.2 R32.2 R36.2 R37.1 R39.2 U6.3(I/O_2)
NetC37_2: C37.2 R31.2 R34.1 R35.2 U6.6(I/O_4)
NetC38_2: C38.2 R30.2 R33.1 R38.2 U6.4(I/O_3)
NetC47_2: C47.2 U10.4(CT)
NetCN8_S: CN8.S U7.60(ANT_MAIN)
NetCN9_S: CN9.S U7.49(ANT_GNSS)
NetCN10_C2: CN10.C2(RST) R33.2
NetCN10_C3: CN10.C3(CLK) R34.2
NetCN10_C7: CN10.C7(I/O) R37.2
NetD2_2: D2.2 TP8.1 U7.75(USB_BOOT)
NetD3_2: D3.2(K) R41.2
NetQ10_3: Q10.3(C) R41.1
NetQ15_2: Q15.2(S) R45.1 R46.2
NetR30_1: R30.1 U5.C2(SIMRST)
NetR31_1: R31.1 U5.C3(SIMCLK)
NetR32_1: R32.1 U5.C7(SIMDATA)
NetR35_1: R35.1 U7.46(USIM_CLK)
NetR36_1: R36.1 U7.45(USIM_DATA)
NetR38_1: R38.1 U7.44(USIM_RST)
NetR40_2: R40.2 TP7.1
NetR42_1: R42.1 U9.11(B3)
NetR43_1: R43.1 U9.10(B4)
NetR48_1: R48.1 U10.5(QOD)
NetTP9_1: TP9.1 U7.8(USB_VBUS)
NetTP10_1: TP10.1 U7.9(USB_DP)
NetTP11_1: TP11.1 U7.10(USB_DM)
NetTP12_1: TP12.1 U7.22(DBG_RXD)
NetTP13_1: TP13.1 U7.23(DBG_TXD)

Not connected (* = marked no-connect by the designer): CN10 C6(VPP)* X1 X2; U5 C4(PIN5)* C6(PIN2)* C8(PIN4)* NC; U6 5(VCC)*; U7 2(ADC1)* 4(PCM_CLK)* 5(PCM_SYNC)* 6(PCM_IN)* 7(PCM_OUT)* 11(RESERVED) 12(RESERVED) 13(RESERVED) 14(RESERVED) 16(RESERVED) 18(W_DISABLE#)* 19(AP_READY)* 24(ADC0)* 25(GPIO1)* 26(GPIO2)* 39(RI)* 40(I2C_SCL)* 41(I2C_SDA)* 42(USIM_PRESENCE)* 51(RESERVED) 56(RESERVED) 57(RESERVED) 63(RESERVED) 64(GPIO3)* 65(GPIO4)* 66(GPIO5)* 76(RESERVED) 77(RESERVED) 78(RESERVED) 83(GRFC1)* 84(GRFC2)* 85(GPIO6)* 86(GPIO7)* 87(GPIO8)* 88(GPIO9)* 92(RESERVED) 93(RESERVED) 94(RESERVED) 95(RESERVED) 97(RESERVED) 98(RESERVED) 99(RESERVED); U8 6(NC)* 9(NC)*; U9 6(NC)* 9(NC)*

### Notes on the sheet
- MODEM BG95
- (near C31) 3.3V - 4.3V
- (near C39) 3.3V - 4.3V
- Size:
- Date:
- A3
- Revision:
- Modified:
- Project:
- Sheet:
- of
- Swiss Innovation Lab AG
- Bernstrasse 18
- 2555 Brügg
- Switzerland
- SIL
- +
- File:

### Library data of the parts
C29 C30 C34 C42 C44-C47 = C_100nF_50V: as C7 on sheet S3220A1; Price: 0,01309; Supplier 1: Digi-Key; Supplier Part Number 1: 445-1314-6-ND
C31 C39 = C_220uF_6.3V: as C1 on sheet S3220A1; Price: 0,59945; Supplier 1: Digi-Key; Supplier Part Number 1: 490-13970-1-ND
C32 C40 C48 = C_22uF_6V3: as C8 on sheet S3220A1; Price: 0,04566; Supplier 1: Digi-Key; Supplier Part Number 1: 1276-1193-1-ND
C33 C41 = C_1uF_50V: 1µF 50V Ceramic Capacitor X5R 0603 (1608 Metric) 0.063" L x 0.032" W (1.60mm x 0.80mm); Manufacturer: Samsung Electro-Mechanics; Manufacturer Part Number: CL10A105KB8NNNC; Value: 1uF; ValueAux: _50V; Currency: $; Price: 0,03472; Supplier 1: Digi-Key; Supplier Part Number 1: 1276-1860-1-ND
C35-C38 C43 = C_33pF_50V: 33pF ±1% 50V Ceramic Capacitor C0G, NP0 0603 (1608 Metric); Manufacturer: Samsung Electro-Mechanics; Manufacturer Part Number: CL10C330FB8NNNC; ValueAux: _50V; Currency: $; Value: 33pF; Price: 0,04166; Supplier 1: Digi-Key; Supplier Part Number 1: 1276-2262-6-ND
CN8 CN9 = CN_RF_uFL: Ultra Miniature Coaxial Connector Jack, Male Pin 50 Ohm Surface Mount Solder; Manufacturer: TE Connectivity AMP Connectors; Manufacturer Part Number: 1909763-1; Currency: $; Value: uFL; Price: 0,25410; Supplier 1: Digi-Key; Supplier Part Number 1: A118077CT-ND
CN10 = CN_MicroSIM-Holder: 6 Position Card Connector Micro SIM Surface Mount, Right Angle Gold; Manufacturer: Molex LLC; Manufacturer Part Number: 0788000001; Currency: $; Value: MicroSIM; Price: 1,14178; Supplier 1: Digi-Key; Supplier Part Number 1: WM9786CT-ND
D2 = D_TVS_15V: TVS DIODE 15V 27.4V DSN1608-2; Manufacturer: Nexperia USA Inc.; Manufacturer Part Number: PTVS15VZ1USKYL; ValueAux: _15V; Currency: $; Value: TVS; Price: 0,09950; Supplier 1: Digi-Key; Supplier Part Number 1: 1727-2745-6-ND
D3 = D_LED_R_5mA: as D1 on sheet S3220A2; Value: LED; Price: 0,07565; Supplier 1: Digi-Key; Supplier Part Number 1: 160-1830-1-ND
Q10-Q14 = Q_DTC143: Pre-Biased Bipolar Transistor (BJT) NPN - Pre-Biased 50V 100mA  200mW Surface Mount SC-75, SOT-416; Manufacturer: ON Semiconductor; Manufacturer Part Number: DTC143ZET1G; Currency: $; Value: DTC143; Price: 0,03338; Supplier 1: Digi-Key; Supplier Part Number 1: DTC143ZET1GOSCT-ND
Q15 = Q_PMV65: as Q1 on sheet S3220A1; Value: PMV65XPEAR; Manufacturer Part Number: PMV65XPEAR; Price: 0,11204; Supplier 1: Digi-Key; Supplier Part Number 1: 1727-2310-1-ND
R30-R34 R37 R42 R43 = R_0_1%: as R1 on sheet S3220A1; Value: 0; Price: 0,00962; Supplier 1: Digi-Key; Supplier Part Number 1: P0.0GCT-ND
R35 R36 R38 = R_22_1%: 22 Ohms ±1% 0.1W, 1/10W Chip Resistor 0603 (1608 Metric) Automotive AEC-Q200 Thick Film; Manufacturer: Panasonic Electronic Components; Manufacturer Part Number: ERJ-3EKF22R0V; Currency: $; Value: 22; Price: 0,01153; Supplier 1: Digi-Key; Supplier Part Number 1: P22.0HCT-ND
R39 = R_15k_1%: 15 kOhms ±1% 0.1W, 1/10W Chip Resistor 0603 (1608 Metric) Automotive AEC-Q200, Moisture Resistant Thick Film; Manufacturer: Yageo; Manufacturer Part Number: AC0603FR-0715KL; Currency: $; Value: 15k; Price: 0,00527; Supplier 1: Digi-Key; Supplier Part Number 1: YAG3569DKR-ND
R40 R44 R47 R49 = R_10k_1%: as R6 on sheet S3220A1; Value: 10k; Price: 0,01449; Supplier 1: Digi-Key; Supplier Part Number 1: P10.0KHCT-ND
R41 R48 = R_68_1%: as R2 on sheet S3220A1; Value: 68; Price: 0,01449; Supplier 1: Digi-Key; Supplier Part Number 1: P68.0HCT-ND
R45 = R_5k6_1%: 5.6 kOhms ±1% 0.1W, 1/10W Chip Resistor 0603 (1608 Metric) Automotive AEC-Q200 Thick Film; Manufacturer: Panasonic Electronic Components; Manufacturer Part Number: ERJ-3EKF5601V; Currency: $; Value: 5k6; Price: 0,01264; Supplier 1: Digi-Key; Supplier Part Number 1: P5.60KHCT-ND
R46 = R_1M_1%: as R3 on sheet S3220A1; Value: 1M; Price: 0,01264; Supplier 1: Digi-Key; Supplier Part Number 1: P1.00MHCT-ND
TP7-TP13 = TP_Test_point: as TP1 on sheet S3220A1; Value: Test point; Manufacturer Part Number: Test point; Price: 0
U5 = U_eSIM-M2M: M2M embedded SIM card IC; Manufacturer: 1NCE; Currency: $; Value: eSIM; Manufacturer Part Number: eSIM; Price: 12,0; Supplier 1: 1NCE; Supplier Part Number 1: eSIM
U6 = U_SRV05-4HTG: TVS DIODE 6V 15V SOT23-6; Manufacturer: Littelfuse Inc.; Currency: $; Value: SRV05-4HTG; Manufacturer Part Number: SRV05-4HTG; Price: 0,40556; Supplier 1: Digi-Key; Supplier Part Number 1: F4204CT-ND
U7 = U_BG95: MultiBand, 3GPP Rel.13, LTE Cat.M1/NB1, GSM/EGPRS, 3xUART, VoLTE; Manufacturer: Quectel; Currency: $; Value: BG95-M3; Manufacturer Part Number: BG95-M3; Price: 15,98590; Supplier 1: Codico; Supplier Part Number 1: BG95-M3
U8 U9 = U_TXB0104: Voltage Level Translator Bidirectional 1 Circuit 4 Channel 100Mbps 14-VQFN (3.5x3.5); Manufacturer: Texas Instruments; Manufacturer Part Number: TXB0104RGYR; Currency: $; Value: TXB0104; Price: 0,65817; Supplier 1: Digi-Key; Supplier Part Number 1: 296-21930-6-ND
U10 = U_TPS22917: as U2 on sheet S3220A1; Value: TPS22917; Price: 0,19065; Supplier 1: Digi-Key; Supplier Part Number 1: 296-50498-1-ND

## Sheet S3220A4.SchDoc: BLE and peripheras
size A3; Revision: A; SheetNumber: 4; SheetTotal: 5
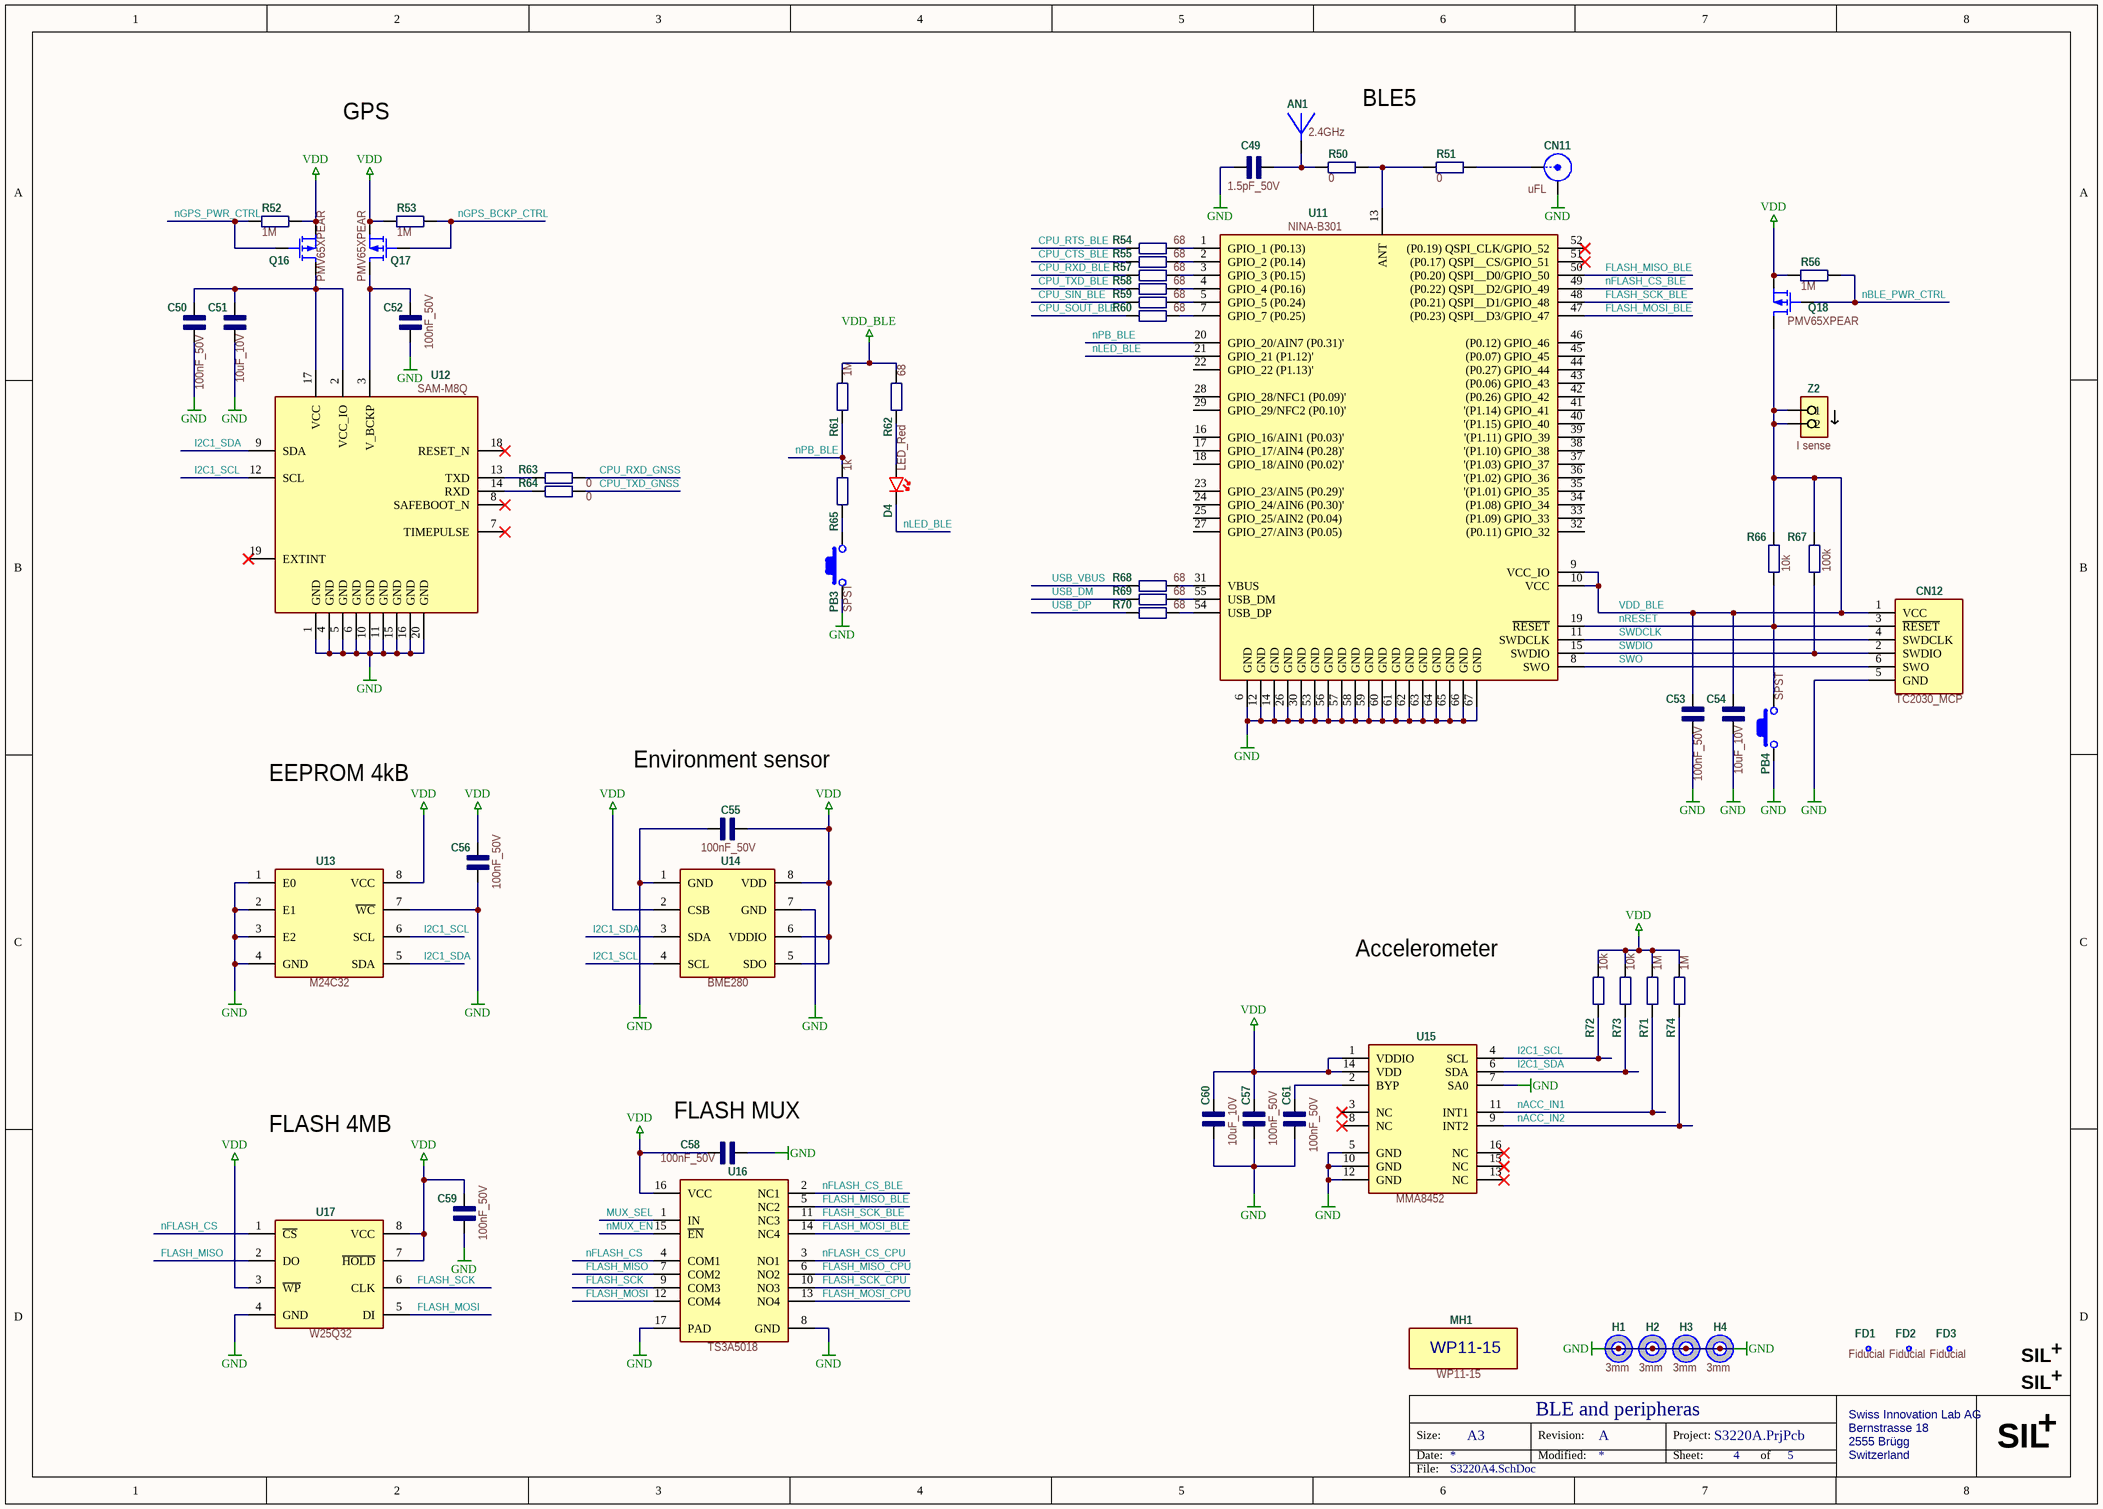
[diagram p3: S3220A4.SchDoc]

### Parts
AN1  2.4GHz  [AN_2400-PCB-B]  (no BOM)
C49  1.5pF_50V  [C_0603]
C50  100nF_50V  [C_0603]
C51  10uF_10V  [C_0603]
C52  100nF_50V  [C_0603]
C53  100nF_50V  [C_0603]
C54  10uF_10V  [C_0603]
C55  100nF_50V  [C_0603]
C56  100nF_50V  [C_0603]
C57  100nF_50V  [C_0603]
C58  100nF_50V  [C_0603]
C59  100nF_50V  [C_0603]
C60  10uF_10V  [C_0603]
C61  100nF_50V  [C_0603]
CN11  uFL  [CN_RF_uFL]
CN12  TC2030_MCP  [CN_TC2030-MCP-NL]  (no BOM)
D4  LED_Red  [LED_0603]
FD1  Fiducial  [FD_Fiducial]  (no BOM)
FD2  Fiducial  [FD_Fiducial]  (no BOM)
FD3  Fiducial  [FD_Fiducial]  (no BOM)
H1  3mm  [H_3M_55M]  (no BOM)
H2  3mm  [H_3M_55M]  (no BOM)
H3  3mm  [H_3M_55M]  (no BOM)
H4  3mm  [H_3M_55M]  (no BOM)
MH1  WP11-15  [MH_WP11-15]  (no BOM)
PB3  SPST  [PB_PTS810]
PB4  SPST  [PB_PTS810]
Q16  PMV65XPEAR  [U_SOT23-3]
Q17  PMV65XPEAR  [U_SOT23-3]
Q18  PMV65XPEAR  [U_SOT23-3]
R50  0  [R_0603]
R51  0  [R_0603]
R52  1M  [R_0603]
R53  1M  [R_0603]
R54  68  [R_0603]
R55  68  [R_0603]
R56  1M  [R_0603]
R57  68  [R_0603]
R58  68  [R_0603]
R59  68  [R_0603]
R60  68  [R_0603]
R61  1M  [R_0603]
R62  68  [R_0603]
R63  0  [R_0603]
R64  0  [R_0603]
R65  1k  [R_0603]
R66  10k  [R_0603]
R67  100k  [R_0603]
R68  68  [R_0603]
R69  68  [R_0603]
R70  68  [R_0603]
R71  1M  [R_0603]
R72  10k  [R_0603]
R73  10k  [R_0603]
R74  1M  [R_0603]
U11  NINA-B301  [U_NINA-B301]
U12  SAM-M8Q  [U_SAM-M8Q]
U13  M24C32  [U_8-SOIC_3.9]
U14  BME280  [U_BME280]
U15  MMA8452  [U_16-QFN-5X3]
U16  TS3A5018  [U_16-VFQFN]
U17  W25Q32  [U_8-SOIC_5.3]
Z2  I sense  [Z_I_SENSE]  (no BOM)
Z3  SIL logo  [Z_SIL-logo]  (value not drawn)  (no BOM)
Z4  SIL logo  [Z_SIL-logo]  (value not drawn)  (no BOM)

### Nets
GND: C49.1 C50.1 C51.1 C52.1 C53.1 C54.1 C55.2 C56.1 C57.2 C58.2 C59.1 C60.1 C61.2 CN11.G CN12.5(GND) H1.0 H2.0 H3.0 H4.0 PB3.2 PB4.1 U11.6(GND) U11.12(GND) U11.14(GND) U11.26(GND) U11.30(GND) U11.53(GND) U11.56(GND) U11.57(GND) U11.58(GND) U11.59(GND) U11.60(GND) U11.61(GND) U11.62(GND) U11.63(GND) U11.64(GND) U11.65(GND) U11.66(GND) U11.67(GND) U12.1(GND) U12.4(GND) U12.5(GND) U12.6(GND) U12.10(GND) U12.11(GND) U12.15(GND) U12.16(GND) U12.20(GND) U13.1(E0) U13.2(E1) U13.3(E2) U13.4(GND) U13.7(~{WC}) U14.1(GND) U14.7(GND) U15.5(GND) U15.7(SA0) U15.10(GND) U15.12(GND) U16.8(GND) U16.17(PAD) U17.4(GND)
VDD: C55.1 C56.2 C57.1 C58.1 C59.2 C60.2 Q16.2(S) Q17.2(S) Q18.2(S) R52.2 R53.2 R56.2 R71.1 R72.2 R73.2 R74.1 U13.8(VCC) U14.2(CSB) U14.5(SDO) U14.6(VDDIO) U14.8(VDD) U15.1(VDDIO) U15.14(VDD) U16.16(VCC) U17.3(~{WP}) U17.7(~{HOLD}) U17.8(VCC)
VDD_BLE: C53.2 C54.2 CN12.1(VCC) Q18.3(D) R61.1 R62.2 R66.2 R67.2 U11.9(VCC_IO) U11.10(VCC) Z2.1 Z2.2
CPU_CTS_BLE: R55.1
CPU_RTS_BLE: R54.1
CPU_RXD_BLE: R57.1
CPU_RXD_GNSS: R63.2
CPU_SIN_BLE: R59.1
CPU_SOUT_BLE: R60.1
CPU_TXD_BLE: R58.1
CPU_TXD_GNSS: R64.2
FLASH_MISO: U16.7(COM2) U17.2(DO)
FLASH_MISO_BLE: U11.50((P0.20)_QSPI__D0/GPIO_50) U16.5(NC2)
FLASH_MISO_CPU: U16.6(NO2)
FLASH_MOSI: U16.12(COM4) U17.5(DI)
FLASH_MOSI_BLE: U11.47((P0.23)_QSPI__D3/GPIO_47) U16.14(NC4)
FLASH_MOSI_CPU: U16.13(NO4)
FLASH_SCK: U16.9(COM3) U17.6(CLK)
FLASH_SCK_BLE: U11.48((P0.21)_QSPI__D1/GPIO_48) U16.11(NC3)
FLASH_SCK_CPU: U16.10(NO3)
I2C1_SCL: R72.1 U12.12(SCL) U13.6(SCL) U14.4(SCL) U15.4(SCL)
I2C1_SDA: R73.1 U12.9(SDA) U13.5(SDA) U14.3(SDA) U15.6(SDA)
MUX_SEL: U16.1(IN)
nACC_IN1: R71.2 U15.11(INT1)
nACC_IN2: R74.2 U15.9(INT2)
nBLE_PWR_CTRL: Q18.1(G) R56.1
nFLASH_CS: U16.4(COM1) U17.1(~{CS})
nFLASH_CS_BLE: U11.49((P0.22)_QSPI__D2/GPIO_49) U16.2(NC1)
nFLASH_CS_CPU: U16.3(NO1)
nGPS_BCKP_CTRL: Q17.1(G) R53.1
nGPS_PWR_CTRL: Q16.1(G) R52.1
nLED_BLE: D4.2(K) U11.21(GPIO_21_(P1.12)')
nMUX_EN: U16.15(~{EN})
nPB_BLE: R61.2 R65.2 U11.20(GPIO_20/AIN7_(P0.31)')
nRESET: CN12.3(~{RESET}) PB4.2 R66.1 U11.19(~{RESET})
SWDCLK: CN12.4(SWDCLK) U11.11(SWDCLK)
SWDIO: CN12.2(SWDIO) R67.1 U11.15(SWDIO)
SWO: CN12.6(SWO) U11.8(SWO)
USB_DM: R69.1
USB_DP: R70.1
USB_VBUS: R68.1
NetAN1_1: AN1.1 C49.2 R50.1
NetC50_2: C50.2 C51.2 Q16.3(D) U12.2(VCC_IO) U12.17(VCC)
NetC52_2: C52.2 Q17.3(D) U12.3(V_BCKP)
NetC61_1: C61.1 U15.2(BYP)
NetCN11_S: CN11.S R51.2
NetD4_1: D4.1(A) R62.1
NetPB3_1: PB3.1 R65.1
NetR50_2: R50.2 R51.1 U11.13(ANT)
NetR54_2: R54.2 U11.1(GPIO_1_(P0.13))
NetR55_2: R55.2 U11.2(GPIO_2_(P0.14))
NetR57_2: R57.2 U11.3(GPIO_3_(P0.15))
NetR58_2: R58.2 U11.4(GPIO_4_(P0.16))
NetR59_2: R59.2 U11.5(GPIO_5_(P0.24))
NetR60_2: R60.2 U11.7(GPIO_7_(P0.25))
NetR63_1: R63.1 U12.13(TXD)
NetR64_1: R64.1 U12.14(RXD)
NetR68_2: R68.2 U11.31(VBUS)
NetR69_2: R69.2 U11.55(USB_DM)
NetR70_2: R70.2 U11.54(USB_DP)

Not connected (* = marked no-connect by the designer): FD1 0; FD2 0; FD3 0; MH1 0; U11 16(GPIO_16/AIN1_(P0.03)') 17(GPIO_17/AIN4_(P0.28)') 18(GPIO_18/AIN0_(P0.02)') 22(GPIO_22_(P1.13)') 23(GPIO_23/AIN5_(P0.29)') 24(GPIO_24/AIN6_(P0.30)') 25(GPIO_25/AIN2_(P0.04)) 27(GPIO_27/AIN3_(P0.05)) 28(GPIO_28/NFC1_(P0.09)') 29(GPIO_29/NFC2_(P0.10)') 32((P0.11)_GPIO_32) 33((P1.09)_GPIO_33) 34((P1.08)_GPIO_34) 35('(P1.01)_GPIO_35) 36('(P1.02)_GPIO_36) 37('(P1.03)_GPIO_37) 38('(P1.10)_GPIO_38) 39('(P1.11)_GPIO_39) 40('(P1.15)_GPIO_40) 41('(P1.14)_GPIO_41) 42((P0.26)_GPIO_42) 43((P0.06)_GPIO_43) 44((P0.27)_GPIO_44) 45((P0.07)_GPIO_45) 46((P0.12)_GPIO_46) 51((P0.17)_QSPI__CS/GPIO_51)* 52((P0.19)_QSPI_CLK/GPIO_52)*; U12 7(TIMEPULSE)* 8(SAFEBOOT_N)* 18(RESET_N)* 19(EXTINT)*; U15 3(NC)* 8(NC)* 13(NC)* 15(NC)* 16(NC)*; Z3 0; Z4 0

### Notes on the sheet
- BLE5
- GPS
- EEPROM 4kB
- Environment sensor
- Accelerometer
- (near C58) FLASH MUX
- FLASH 4MB
- Size:
- Date:
- A3
- Revision:
- Modified:
- Project:
- Sheet:
- of
- Swiss Innovation Lab AG
- Bernstrasse 18
- 2555 Brügg
- Switzerland
- SIL
- +
- File:
- (in symbol Z_SIL_logo) +; SIL

### Library data of the parts
AN1 = AN_2.4GHz-PCB: 2.4 GHz PCB antenna; Manufacturer: Swiss Innovation Lab; Manufacturer Part Number: SIL AN24GHZ; Currency: $; Value: 2.4GHz; Price: 0; Supplier 1: SIL; Supplier Part Number 1: SIL AN24GHZ
C49 = C_1.5pF_50V: 1.5pF ±0.1pF 50V Ceramic Capacitor C0G, NP0 0603 (1608 Metric); Manufacturer: Samsung Electro-Mechanics; Manufacturer Part Number: CL10C1R5BB8NNNC; ValueAux: _50V; Currency: $; Value: 1.5pF; Price: 0,01291; Supplier 1: Digi-Key; Supplier Part Number 1: 1276-1071-1-ND
C50 C52 C53 C55-C59 C61 = C_100nF_50V: as C7 on sheet S3220A1; Price: 0,01309; Supplier 1: Digi-Key; Supplier Part Number 1: 445-1314-6-ND
C51 C54 C60 = C_10uF_10V: as C18 on sheet S3220A2; Price: 0,03994; Supplier 1: Digi-Key; Supplier Part Number 1: 490-10474-1-ND
CN11 = CN_RF_uFL: as CN8 on sheet S3220A3; Value: uFL; Price: 0,25410; Supplier 1: Digi-Key; Supplier Part Number 1: A118077CT-ND
CN12 = CN_TC2030: as CN7 on sheet S3220A2; Price: 0
D4 = D_LED_R_5mA: as D1 on sheet S3220A2; Value: LED; Price: 0,07565; Supplier 1: Digi-Key; Supplier Part Number 1: 160-1830-1-ND
FD1-FD3 = FD_Fiducial: Reference point for assembly machine; Manufacturer: Swiss Innovation Lab; Currency: $; Value: Fiducial; Manufacturer Part Number: Fiducial; Price: 0; Supplier 1: Swiss Innovation Lab; Supplier Part Number 1: Fiducial
H1-H4 = H_3M_55M: Hole 3mm, Pad 5.5mm; Manufacturer: Swissinnolab; Currency: $; Value: 3mm; Price: 0
MH1 = MH_WP11-15: Case Takachi WP11-15; Currency: $; Value: WP11-15; Manufacturer: Takachi; Manufacturer Part Number: WP11-15; Price: 0
PB3 PB4 = PB_SPST_2.5mm: as PB1 on sheet S3220A2; Value: SPST; Price: 0,17302; Supplier 1: Digi-Key; Supplier Part Number 1: CKN10502DKR-ND
Q16-Q18 = Q_PMV65: as Q1 on sheet S3220A1; Value: PMV65XPEAR; Manufacturer Part Number: PMV65XPEAR; Price: 0,11204; Supplier 1: Digi-Key; Supplier Part Number 1: 1727-2310-1-ND
R50 R51 R63 R64 = R_0_1%: as R1 on sheet S3220A1; Value: 0; Price: 0,00962; Supplier 1: Digi-Key; Supplier Part Number 1: P0.0GCT-ND
R52 R53 R56 R61 R71 R74 = R_1M_1%: as R3 on sheet S3220A1; Value: 1M; Price: 0,01264; Supplier 1: Digi-Key; Supplier Part Number 1: P1.00MHCT-ND
R54 R55 R57-R60 R62 R68-R70 = R_68_1%: as R2 on sheet S3220A1; Value: 68; Price: 0,01449; Supplier 1: Digi-Key; Supplier Part Number 1: P68.0HCT-ND
R65 = R_1k_1%: as R16 on sheet S3220A2; Value: 1k; Price: 0,01153; Supplier 1: Digi-Key; Supplier Part Number 1: P1.00KHCT-ND
R66 R72 R73 = R_10k_1%: as R6 on sheet S3220A1; Value: 10k; Price: 0,01449; Supplier 1: Digi-Key; Supplier Part Number 1: P10.0KHCT-ND
R67 = R_100k_1%: 100 kOhms ±1% 0.1W, 1/10W Chip Resistor 0603 (1608 Metric) Automotive AEC-Q200 Thick Film; Manufacturer: Panasonic Electronic Components; Manufacturer Part Number: ERJ-3EKF1003V; Currency: $; Value: 100k; Price: 0,01367; Supplier 1: Digi-Key; Supplier Part Number 1: P100KHCT-ND
U11 = U_NINA-B301: MOD BLE 4.2 NORDIC NRF52840 SOC; Manufacturer: uBlox; Currency: $; Value: NINA-B301; Manufacturer Part Number: NINA-B301; Price: 7,5; Supplier 1: uBlox; Supplier Part Number 1: NINA-B301
U12 = U_SAM-M8Q: SAM-M8Q RF Receiver Galileo, GLONASS, GPS 1.575GHz, 1.602GHz -165dBm 400kbps; Manufacturer: U-Blox America Inc.; Manufacturer Part Number: SAM-M8Q-0-10; Currency: $; Value: SAM-M8Q; Price: 12,75120; Supplier 1: Digi-Key; Supplier Part Number 1: 672-1054-1-ND
U13 = U_M24C32: EEPROM Memory IC 32Kb (4K x 8) I2C 1MHz 450ns 8-SO; Manufacturer: STMicroelectronics; Manufacturer Part Number: M24C32-WMN6TP; Currency: $; Value: M24C32; Price: 0,18324; Supplier 1: Digi-Key; Supplier Part Number 1: 497-5027-1-ND
U14 = U_BME280: Humidity Temperature Sensor 0 ~ 100% RH I2C, SPI ±3% 1s Surface Mount; Manufacturer: Bosch Sensortec; Currency: $; Value: BME280; Manufacturer Part Number: BME280; Price: 3,71140; Supplier 1: Digi-Key; Supplier Part Number 1: 828-1063-1-ND
U15 = U_MMA8452: Accelerometer X, Y, Z Axis ±2g, 4g, 8g 0.78Hz ~ 400Hz 16-QFN (3x3); Manufacturer: NXP USA Inc.; Manufacturer Part Number: MMA8452QT; Currency: $; Value: MMA8452; Price: 1,09888; Supplier 1: Digi-Key; Supplier Part Number 1: MMA8452QT-ND
U16 = U_TS3A5018: 4 Circuit IC Switch 2:1 10Ohm 16-UQFN (2.6x1.8); Manufacturer: Texas Instruments; Manufacturer Part Number: TS3A5018RGYR; Currency: $; Value: TS3A5018; Price: 0,25928; Supplier 1: Digi-Key; Supplier Part Number 1: 296-19899-1-ND
U17 = U_W25Q32: FLASH - NOR Memory IC 32Mb (4M x 8) SPI - Quad I/O 133MHz  8-SOIC; Manufacturer: Winbond Electronics; Manufacturer Part Number: W25Q32JVSSIQ; Currency: $; Value: W25Q32; Price: 0,97; Supplier 1: Digi-Key; Supplier Part Number 1: W25Q32JVSSIQ-ND
Z2 = Z_I_sense: as Z1 on sheet S3220A2; Value: I sense; Manufacturer Part Number: I sense; Price: 0; Supplier 1: SIL; Supplier Part Number 1: I sense
Z3 Z4 = Z_SIL_logo: Manufacturer: Swiss Innovation Lab; Currency: $; Value: SIL logo; Manufacturer Part Number: SIL Logo; Price: 0; Supplier 1: Swiss Innovation Lab; Supplier Part Number 1: SIL Logo

## Nets that join several sheets
GND: S3220A1 (40 pins), S3220A2 (30 pins), S3220A3 (65 pins), S3220A4 (62 pins)
VDD: S3220A1 (16 pins), S3220A2 (26 pins), S3220A3 (U10.1), S3220A4 (27 pins)
BATTERY_AIN: S3220A1 (R3.1 R4.2 TP2.1), S3220A2 (U3.35)
CPU_CTS_BLE: S3220A2 (U3.23), S3220A4 (R55.1)
CPU_CTS_MODEM: S3220A2 (U3.58), S3220A3 (U8.10)
CPU_DCD_MODEM: S3220A2 (U3.61), S3220A3 (U9.12)
CPU_DTR_MODEM: S3220A2 (U3.60), S3220A3 (U9.13)
CPU_RTS_BLE: S3220A2 (U3.24), S3220A4 (R54.1)
CPU_RTS_MODEM: S3220A2 (U3.59), S3220A3 (U8.11)
CPU_RXD_BLE: S3220A2 (U3.26), S3220A4 (R57.1)
CPU_RXD_GNSS: S3220A2 (U3.15), S3220A3 (R42.2), S3220A4 (R63.2)
CPU_RXD_MODEM: S3220A2 (U3.56), S3220A3 (U8.12)
CPU_SIN_BLE: S3220A2 (U3.90), S3220A4 (R59.1)
CPU_SOUT_BLE: S3220A2 (U3.37), S3220A4 (R60.1)
CPU_TXD_BLE: S3220A2 (U3.25), S3220A4 (R58.1)
CPU_TXD_GNSS: S3220A2 (U3.16), S3220A3 (R43.2), S3220A4 (R64.2)
CPU_TXD_MODEM: S3220A2 (U3.55), S3220A3 (U8.13)
EPAPER_BUSY: S3220A1 (CN2.B2), S3220A2 (U3.83)
EPAPER_MOSI: S3220A1 (CN2.A10), S3220A2 (U3.85)
EPAPER_SCK: S3220A1 (CN2.A11), S3220A2 (U3.82)
FLASH_MISO_CPU: S3220A2 (U3.31), S3220A4 (U16.6)
FLASH_MOSI_CPU: S3220A2 (U3.32), S3220A4 (U16.13)
FLASH_SCK_CPU: S3220A2 (U3.30), S3220A4 (U16.10)
I2C1_SCL: S3220A2 (U3.95), S3220A4 (5 pins)
I2C1_SDA: S3220A2 (U3.96), S3220A4 (5 pins)
I2C2_SCL: S3220A1 (CN2.A8 CN3.4 CN4.4 R6.1), S3220A2 (M1.4 U3.47)
I2C2_SDA: S3220A1 (CN2.B8 CN3.3 CN4.3 R7.1), S3220A2 (M1.3 U3.48)
MODEM_LVL_SHF_EN: S3220A2 (U3.43), S3220A3 (U8.8 U9.8)
MODEM_PSM_IND: S3220A2 (U3.46), S3220A3 (Q13.3 R47.2)
MODEM_STATUS: S3220A2 (U3.45), S3220A3 (Q11.3 R44.2)
MODEM_VDD_PWR_CTRL: S3220A2 (U3.54), S3220A3 (U10.3)
MUX_SEL: S3220A2 (U3.33), S3220A4 (U16.1)
nACC_IN1: S3220A2 (U3.38), S3220A4 (R71.2 U15.11)
nACC_IN2: S3220A2 (U3.39), S3220A4 (R74.2 U15.9)
nBLE_PWR_CTRL: S3220A2 (U3.91), S3220A4 (Q18.1 R56.1)
nCC1_LED: S3220A1 (CN2.A5), S3220A2 (R16.1)
nCC2_LED: S3220A1 (CN2.B5), S3220A2 (R17.1)
nEPAPER_CS: S3220A1 (CN2.B11), S3220A2 (U3.81)
nEPAPER_DC: S3220A1 (CN2.B10), S3220A2 (U3.87)
nEPAPER_RES: S3220A1 (CN2.B3), S3220A2 (U3.86)
nFLASH_CS_CPU: S3220A2 (U3.29), S3220A4 (U16.3)
nGPS_BCKP_CTRL: S3220A2 (U3.65), S3220A4 (Q17.1 R53.1)
nGPS_PWR_CTRL: S3220A2 (U3.66), S3220A4 (Q16.1 R52.1)
nMODEM_PON_TRIG: S3220A2 (U3.44), S3220A3 (Q15.1 R46.1)
nMODEM_PWRKEY: S3220A2 (U3.53), S3220A3 (Q12.1)
nMODEM_RESET: S3220A2 (U3.52), S3220A3 (Q14.1)
nMUX_EN: S3220A2 (U3.34), S3220A4 (U16.15)
nRELAY_1: S3220A1 (C9.2 CN5.1 R8.1), S3220A2 (U3.40)
nRELAY_2: S3220A1 (C10.2 CN6.1 R9.1), S3220A2 (U3.41)
QWIIC_PWR_CTRL: S3220A1 (Q8.1 R5.1), S3220A2 (U3.62)
USB_DM: S3220A1 (U1.1), S3220A2 (R14.1), S3220A4 (R69.1)
USB_DP: S3220A1 (U1.3), S3220A2 (R15.1), S3220A4 (R70.1)
USB_INT: S3220A1 (R11.1), S3220A2 (U3.4)
USB_VBUS: S3220A1 (R1.2), S3220A2 (R13.1), S3220A4 (R68.1)
VBUS_AIN: S3220A1 (R10.1 R11.2 R12.2 TP3.1), S3220A2 (M1.9 U3.36)
VBUSC_PWR_CTRL: S3220A1 (U2.3), S3220A2 (U3.5)

## Assembly variants
S3220A_A: not fitted C24 C29 C30 C31 C32 C33 C130 C133 C134 CN1 CN3 CN8 CN9 CN10 CN10 CN12 CN16 D17 R1 R1 R2 R5 R7 R9 R11 R12 R13 R14 R25 R27 R32 R38 R39 R39 R40 R65 R66 R67 R117 R127 R214 R216 U18